# EAGLE schematic N_50412K (EAGLE 8.4.1)
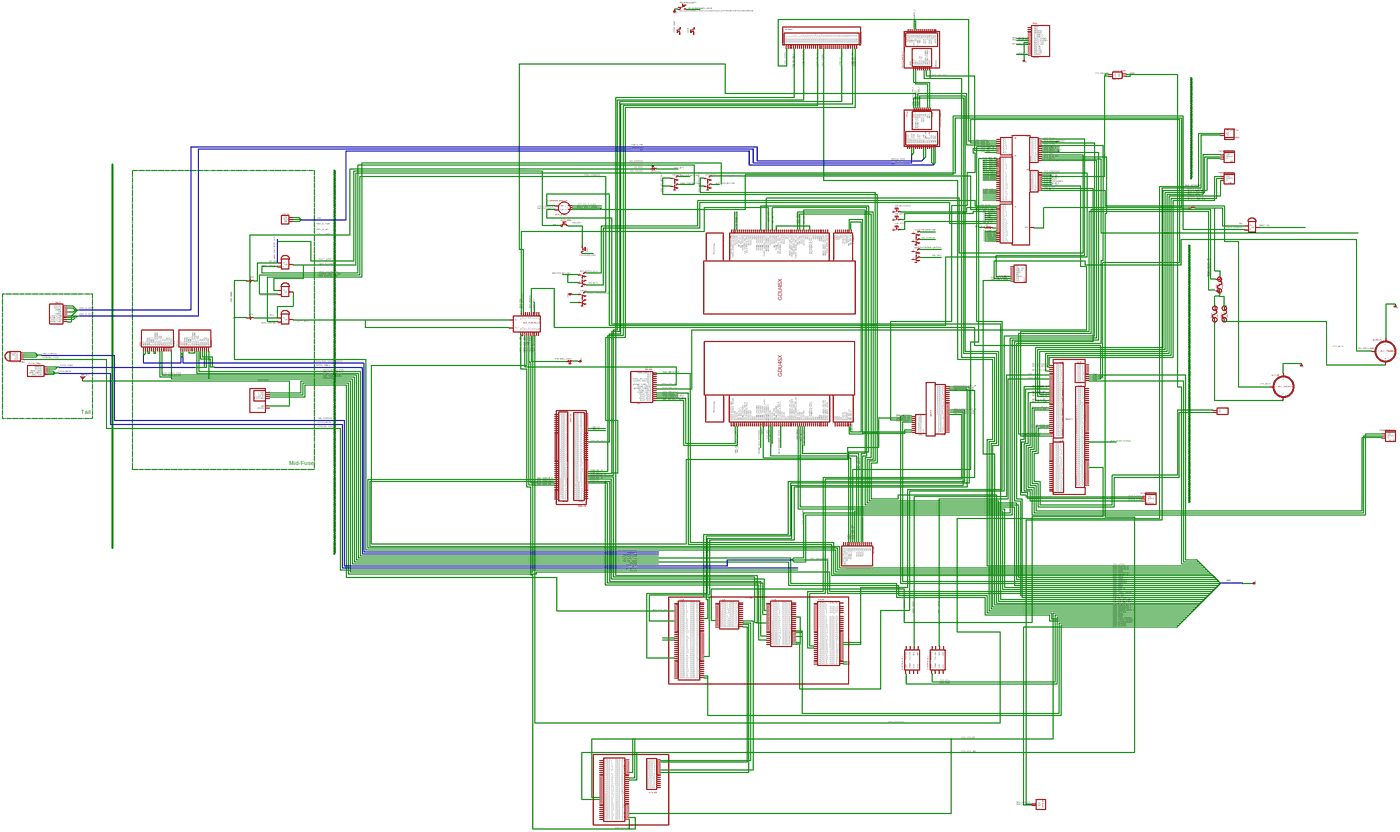
[diagram p0: schematic, sheet 1, overview]
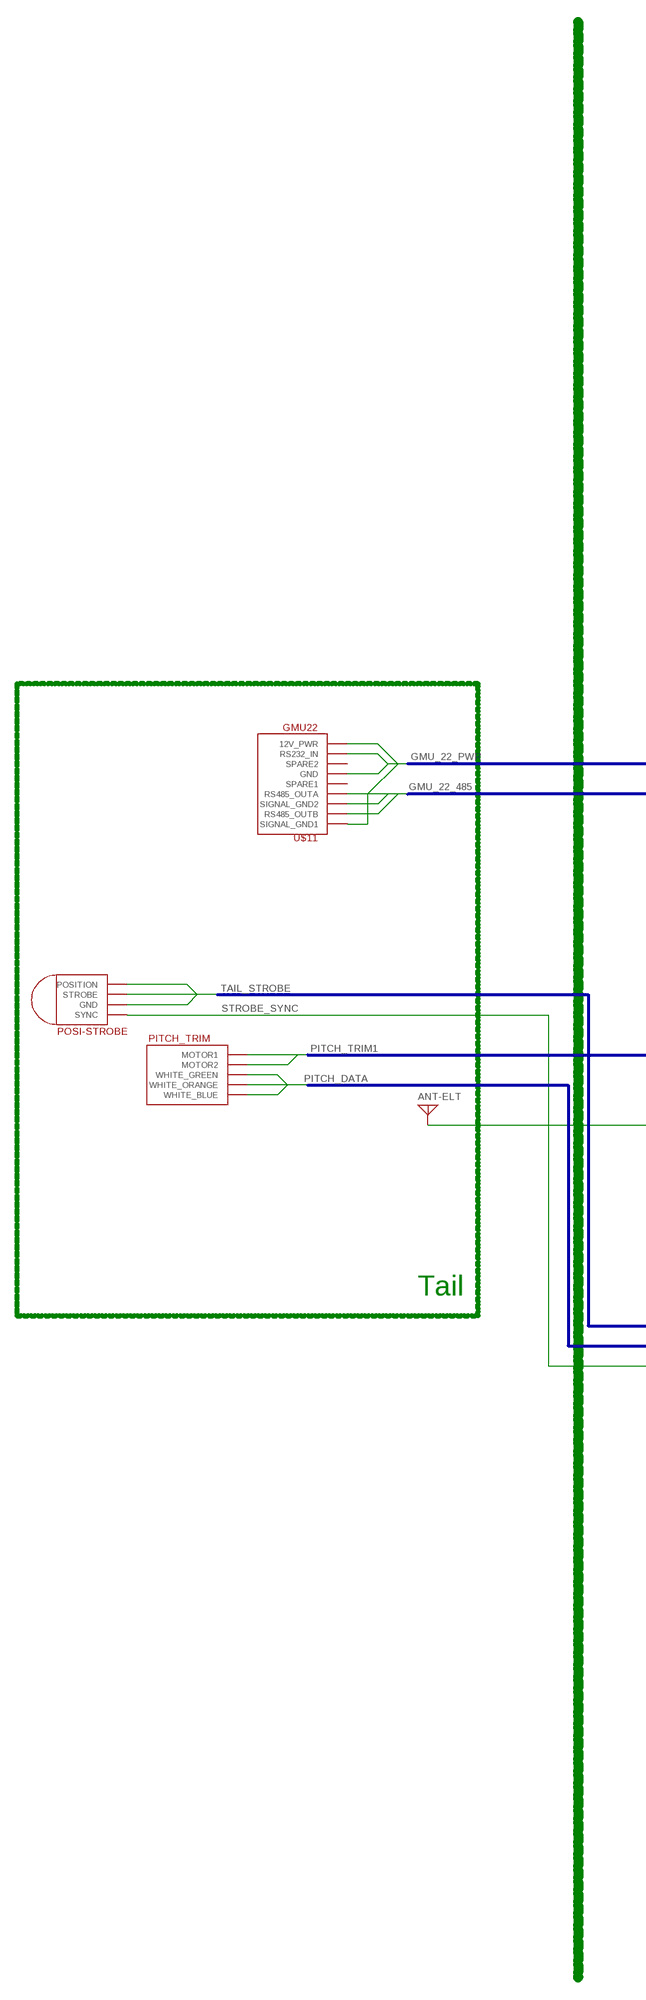
[diagram p1: schematic, sheet 1, part 1 of 8]
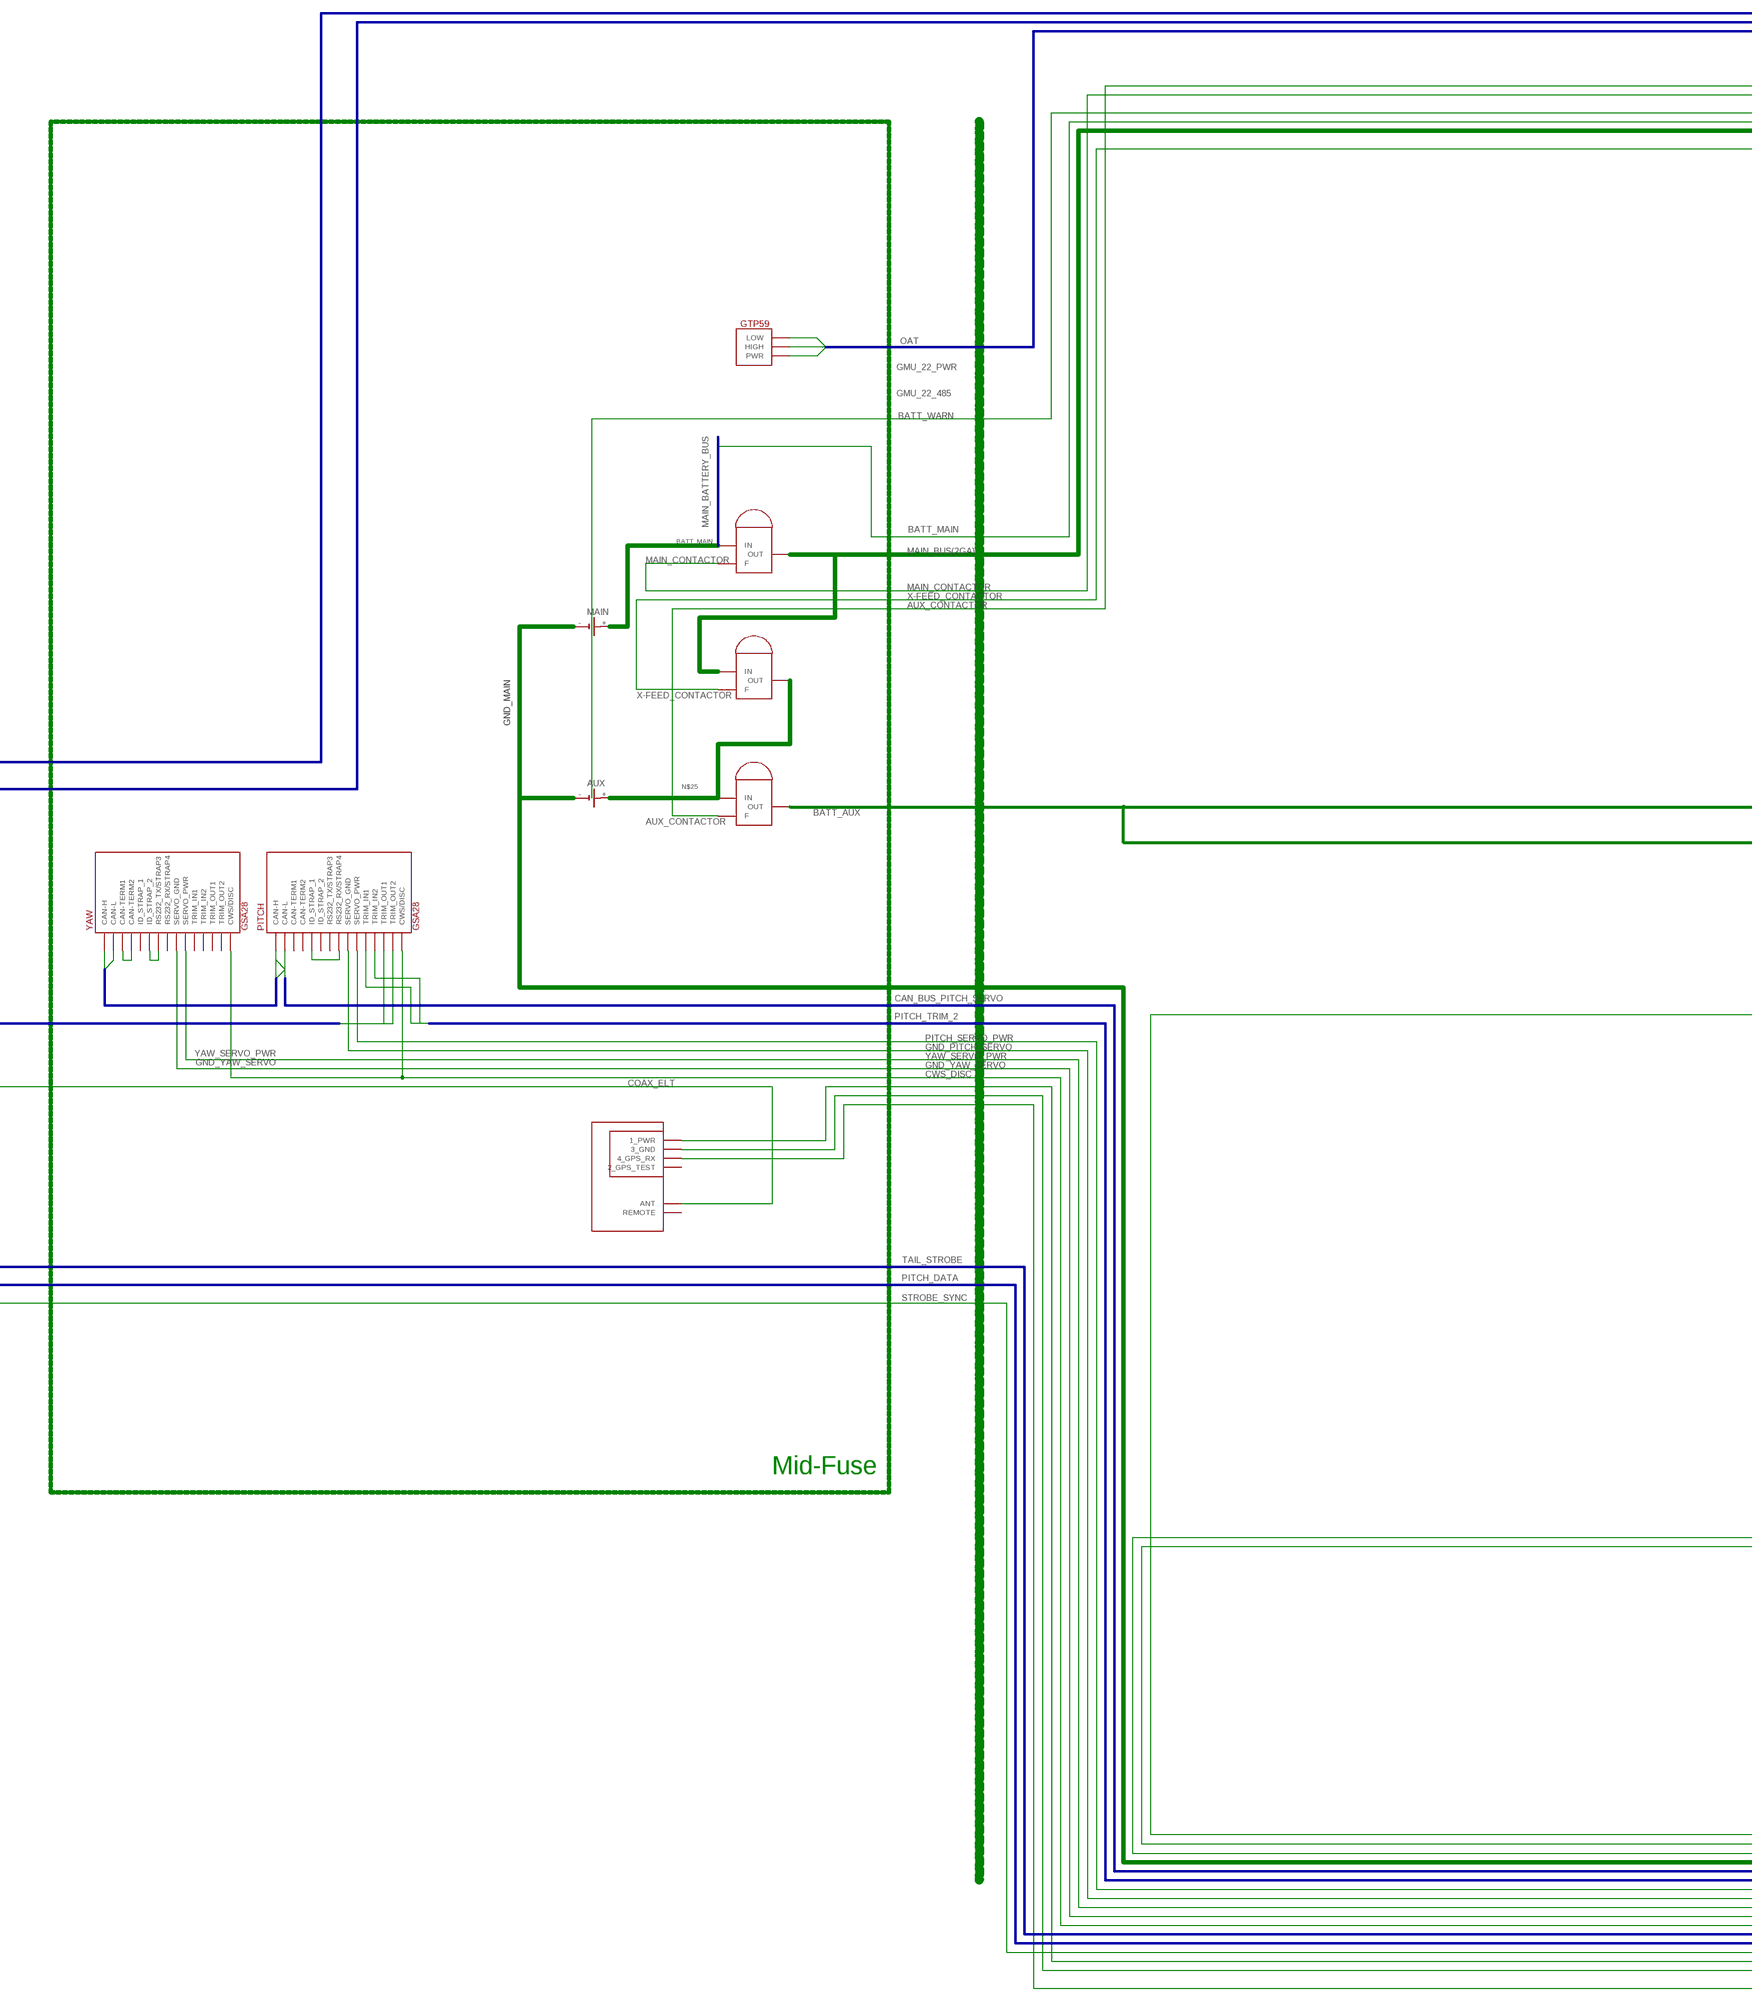
[diagram p2: schematic, sheet 1, part 2 of 8]
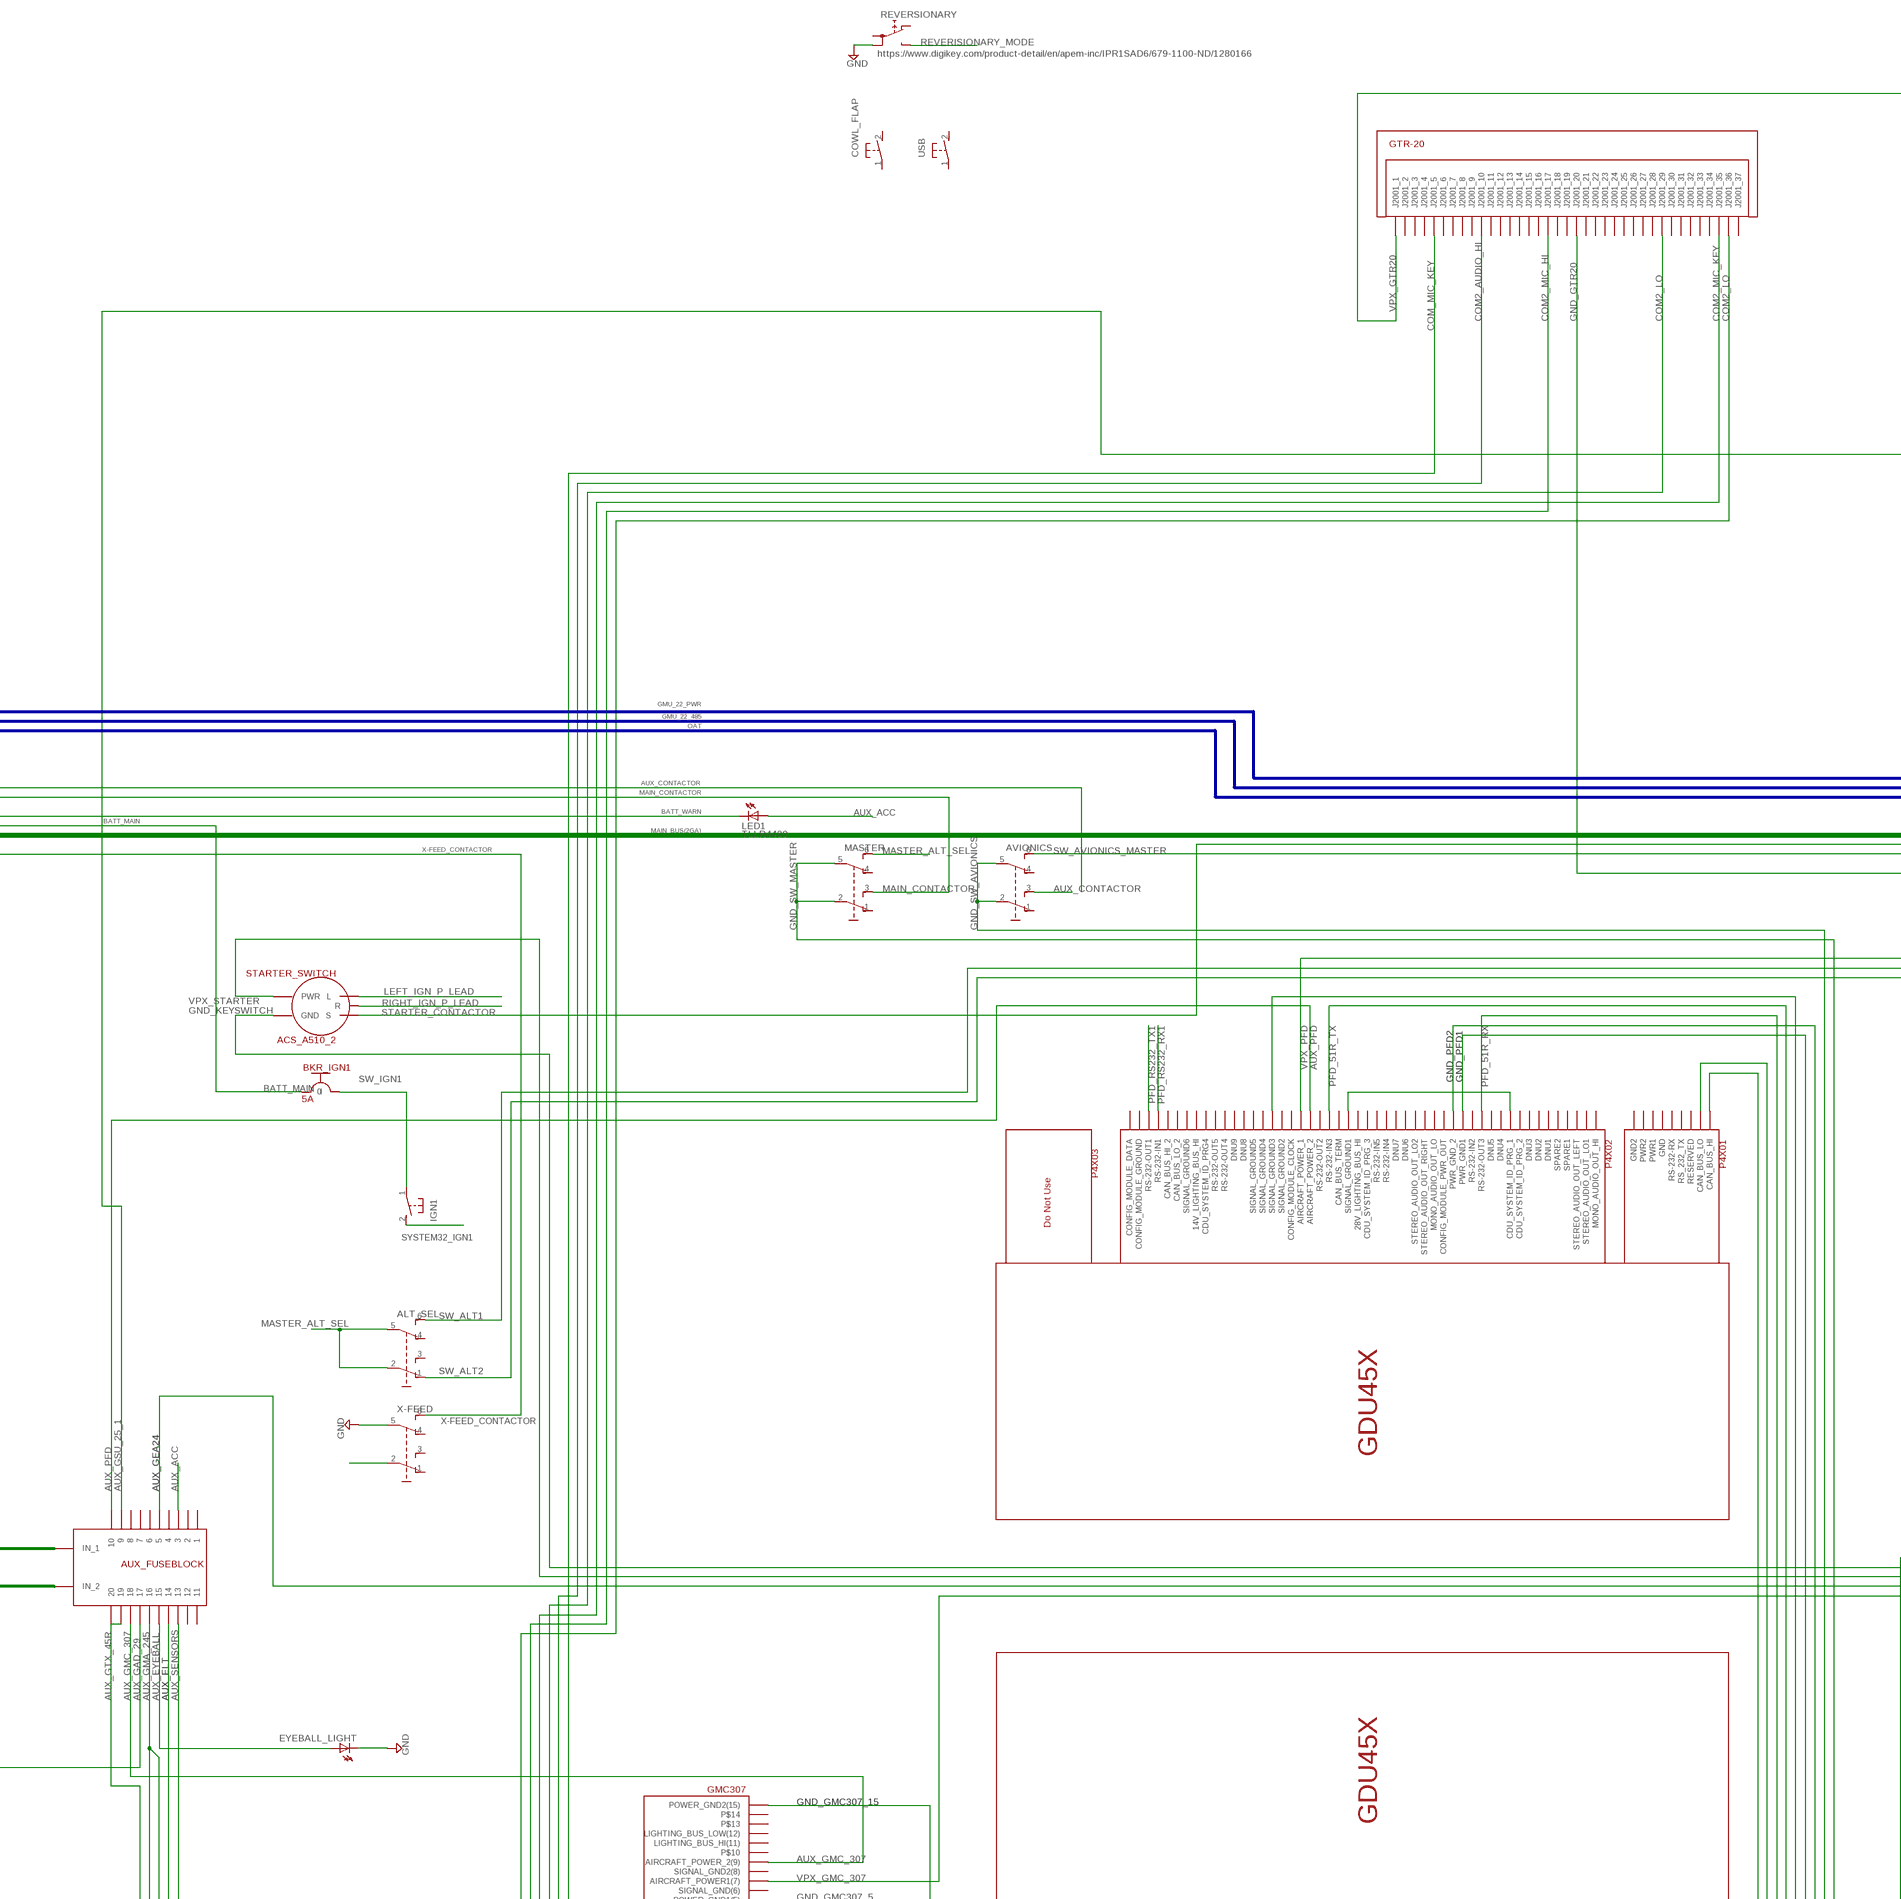
[diagram p3: schematic, sheet 1, part 3 of 8]
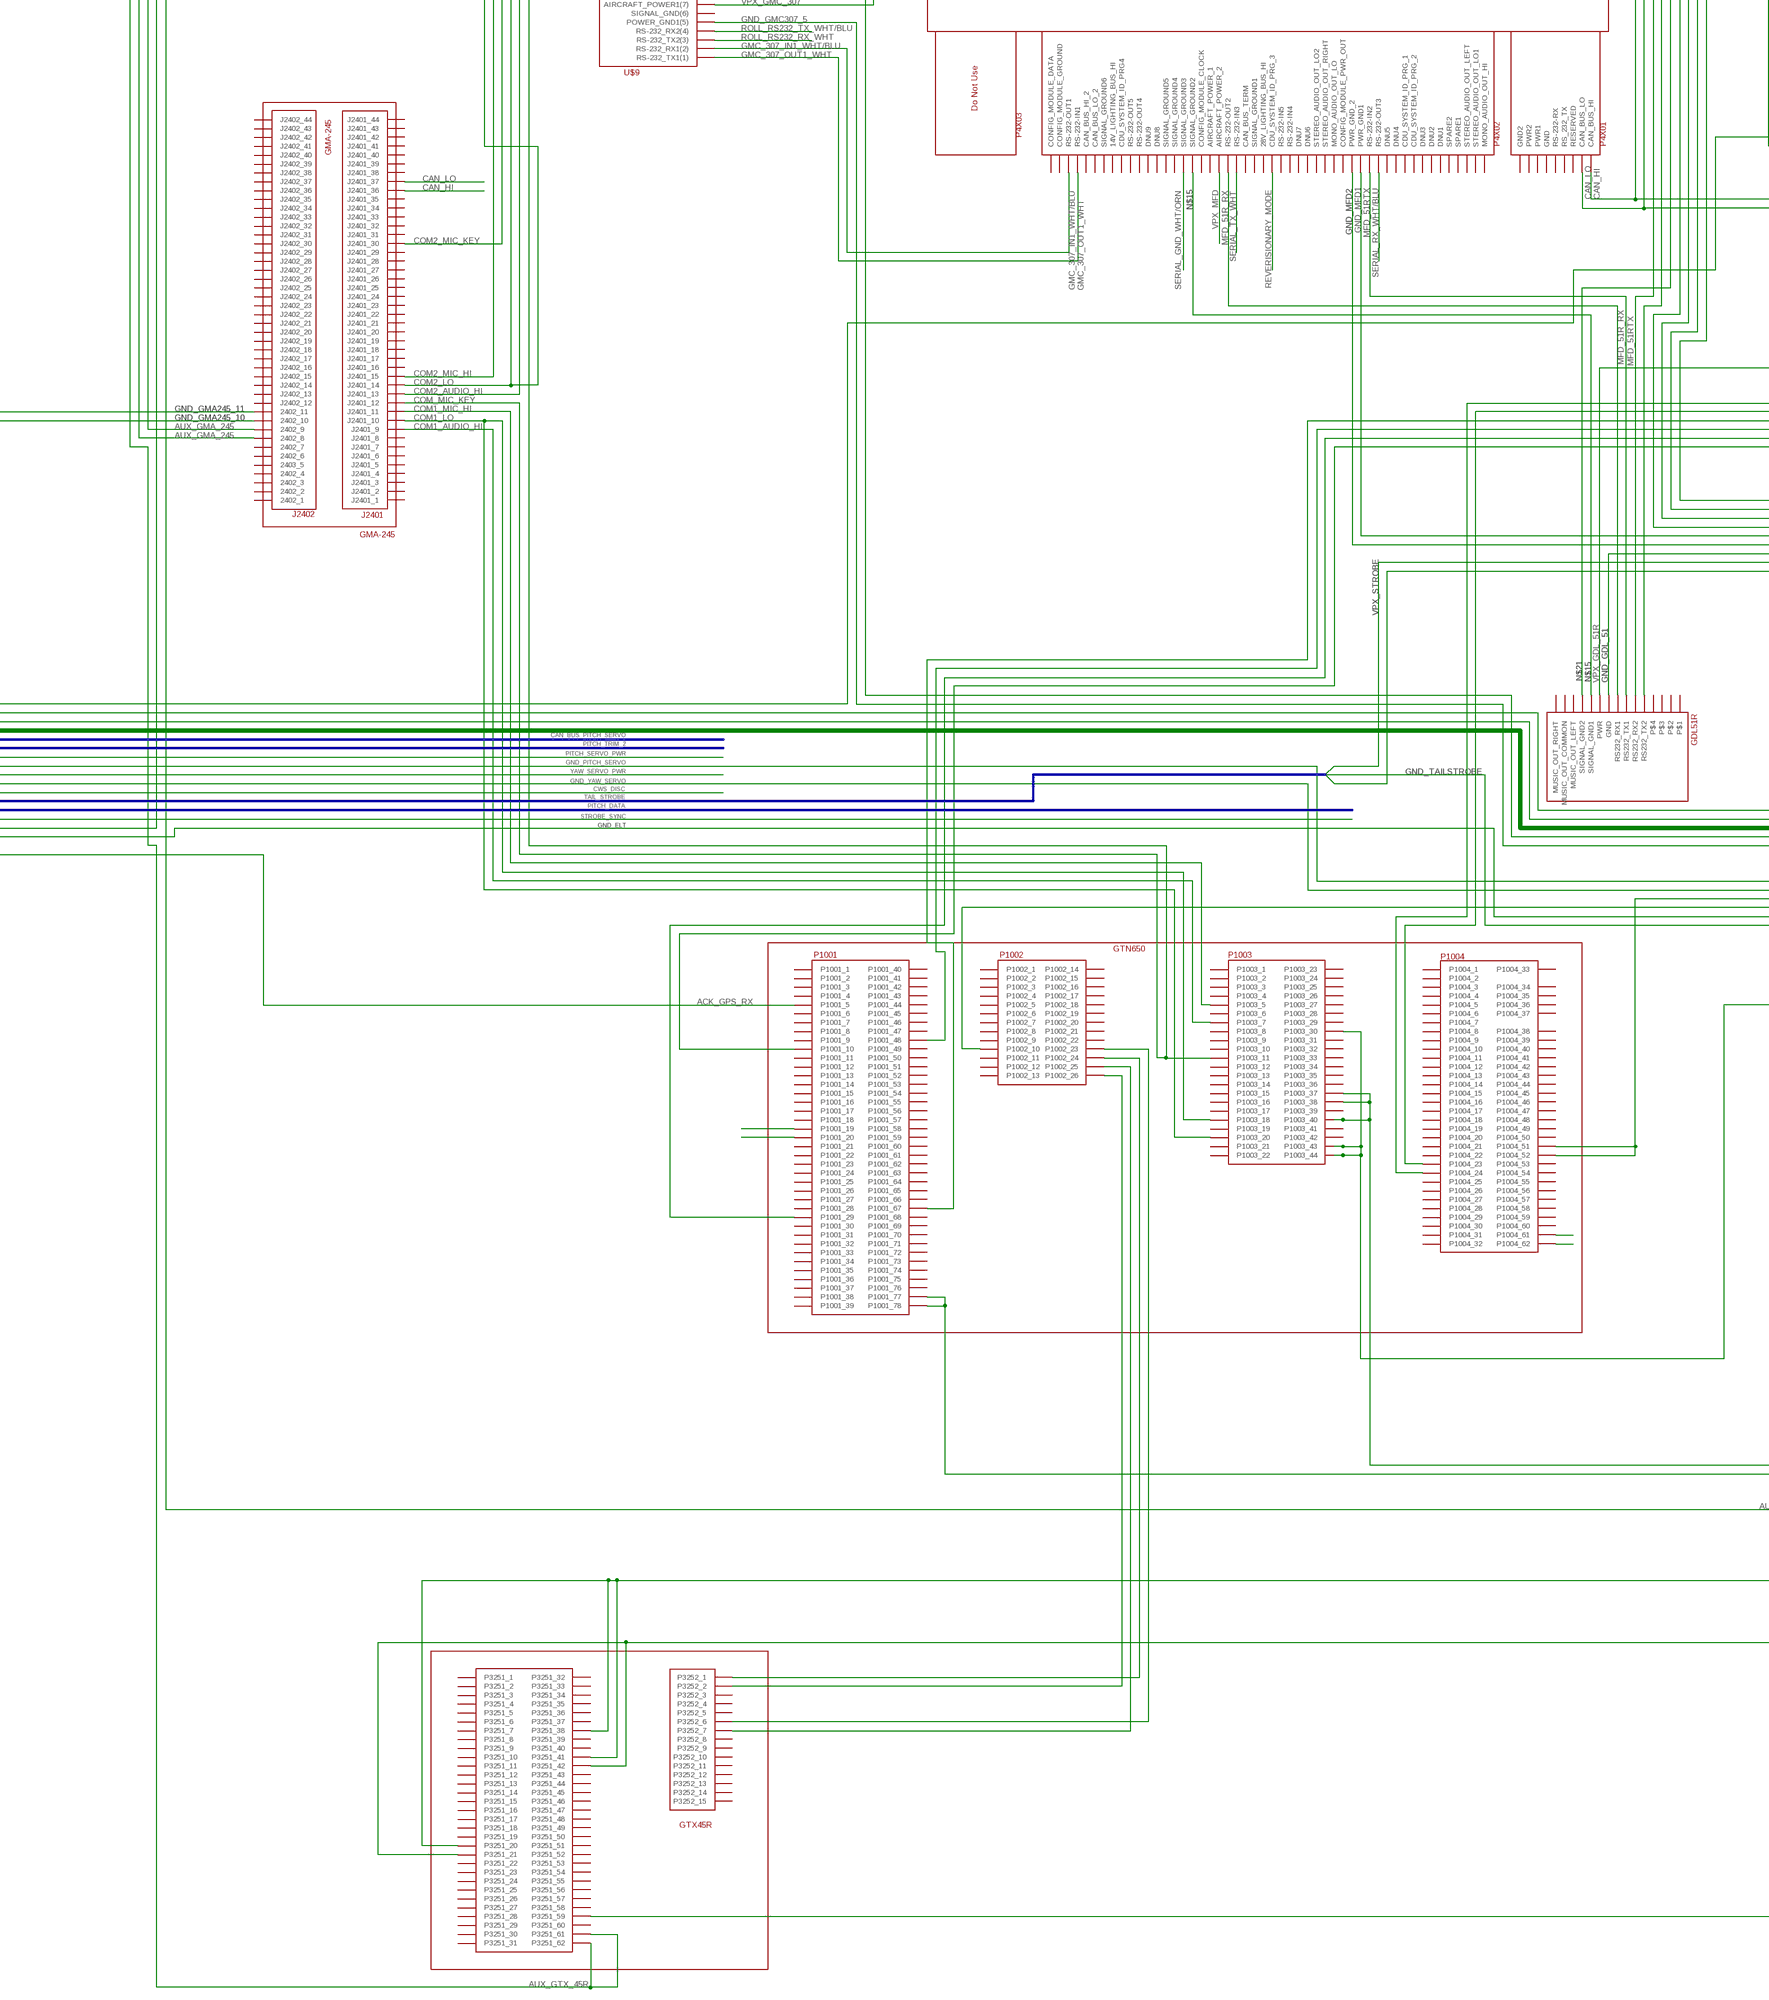
[diagram p4: schematic, sheet 1, part 4 of 8]
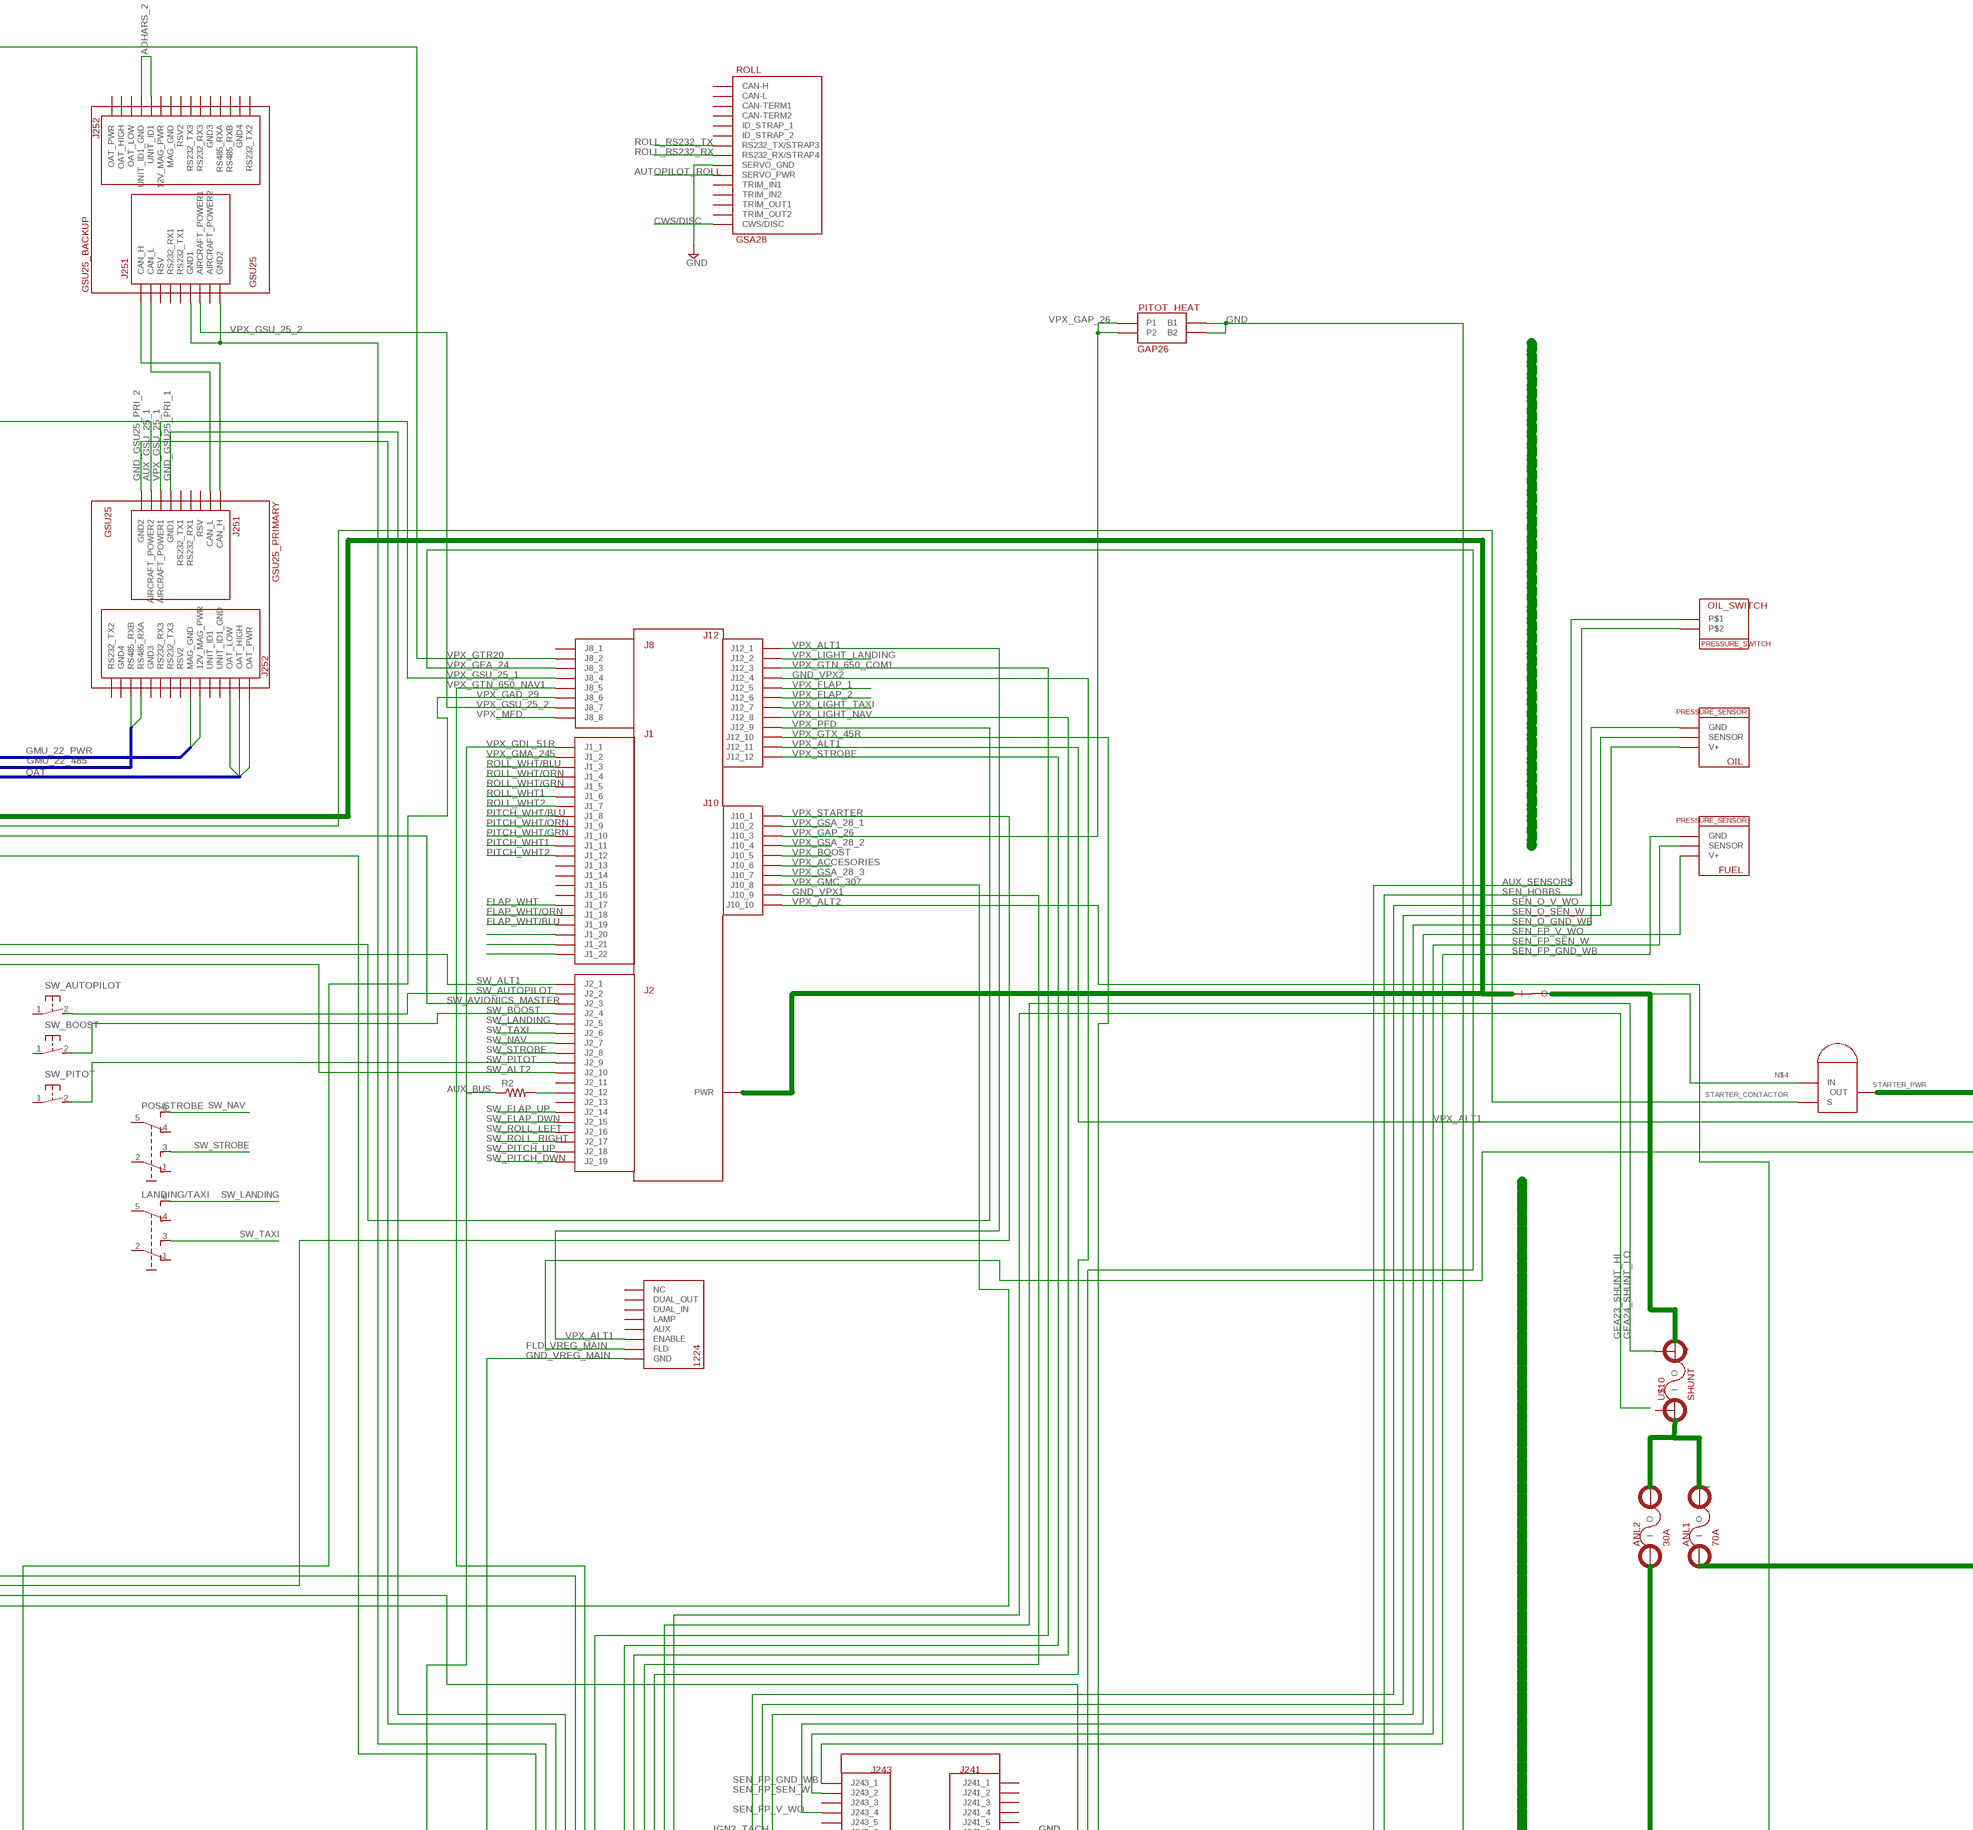
[diagram p5: schematic, sheet 1, part 5 of 8]
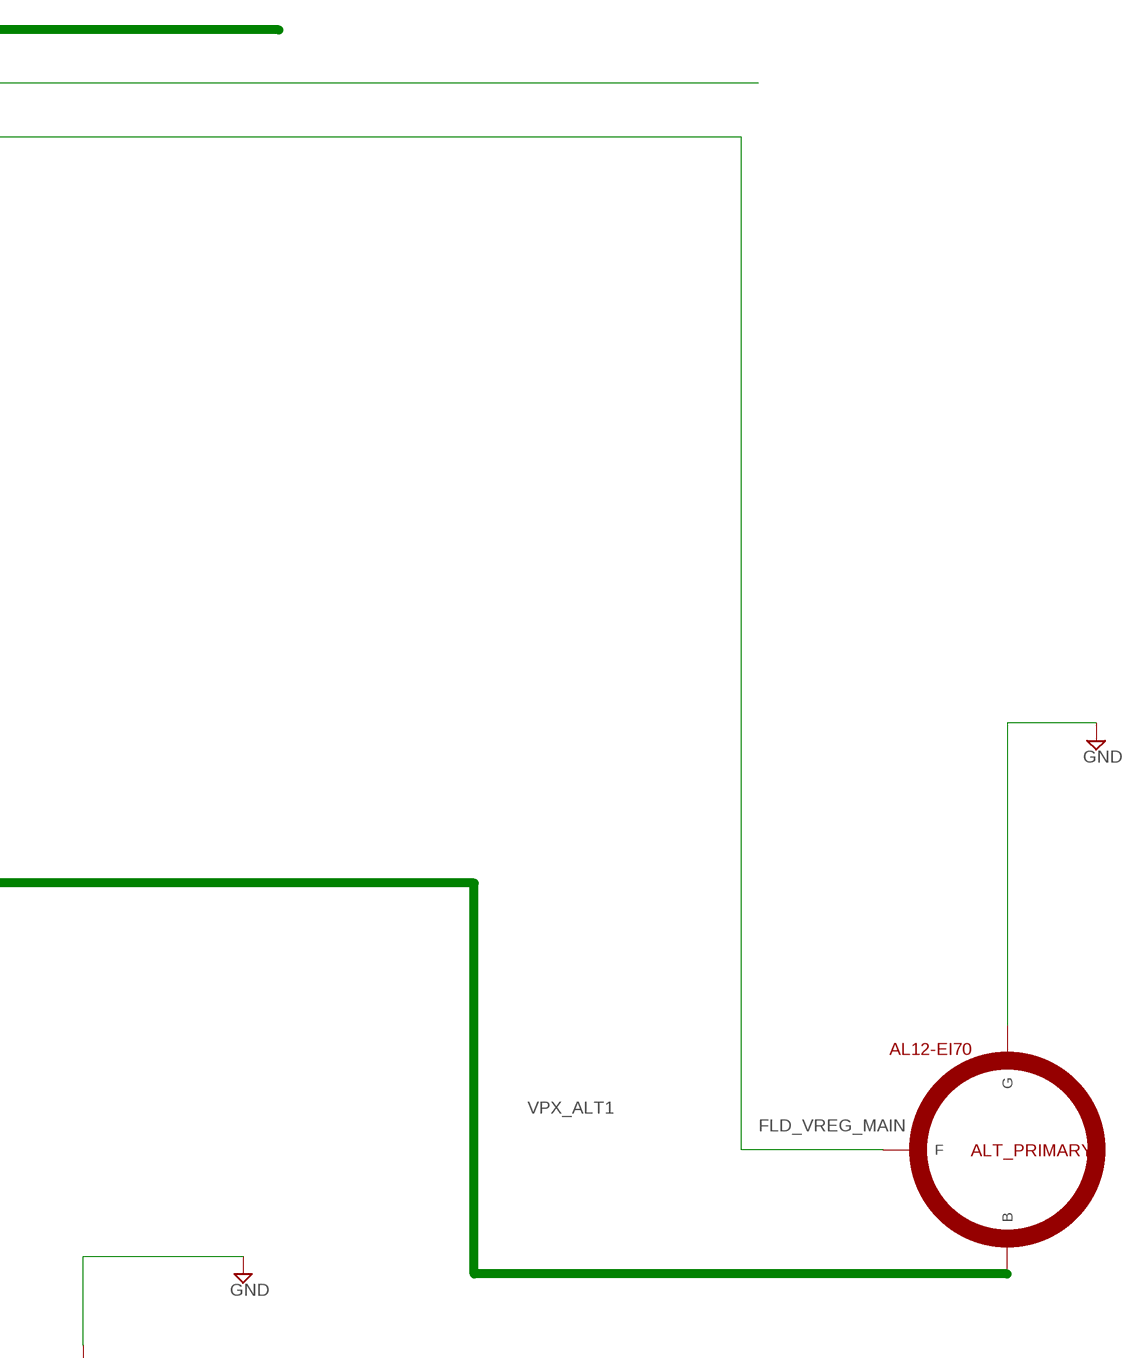
[diagram p6: schematic, sheet 1, part 6 of 8]
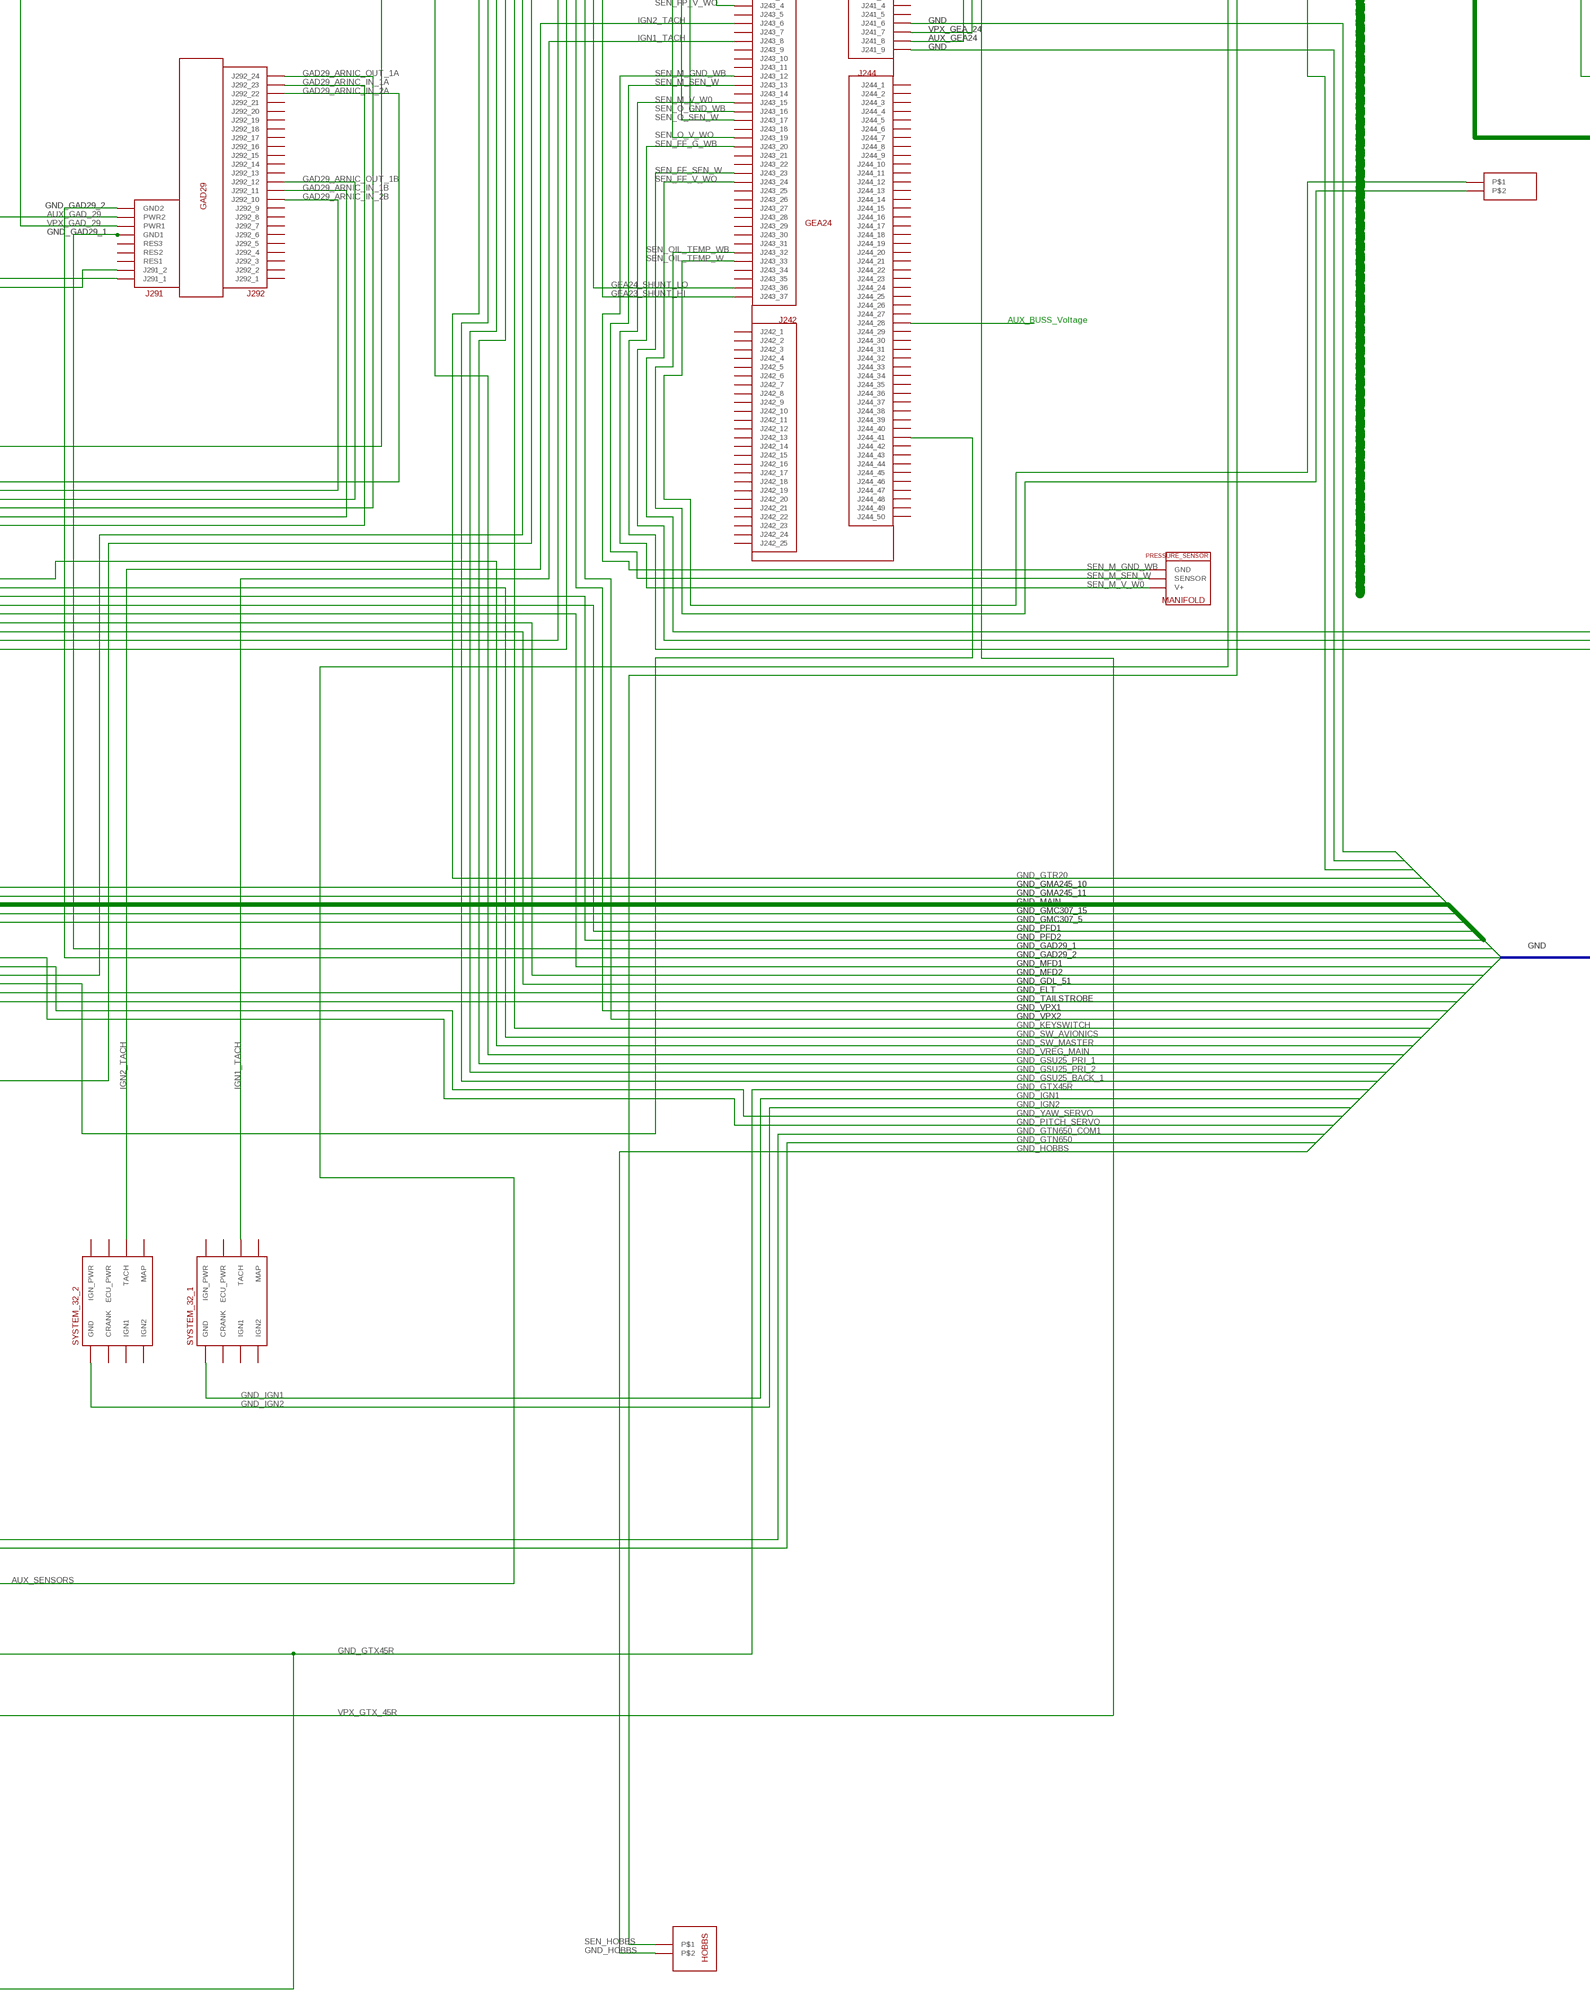
[diagram p7: schematic, sheet 1, part 7 of 8]
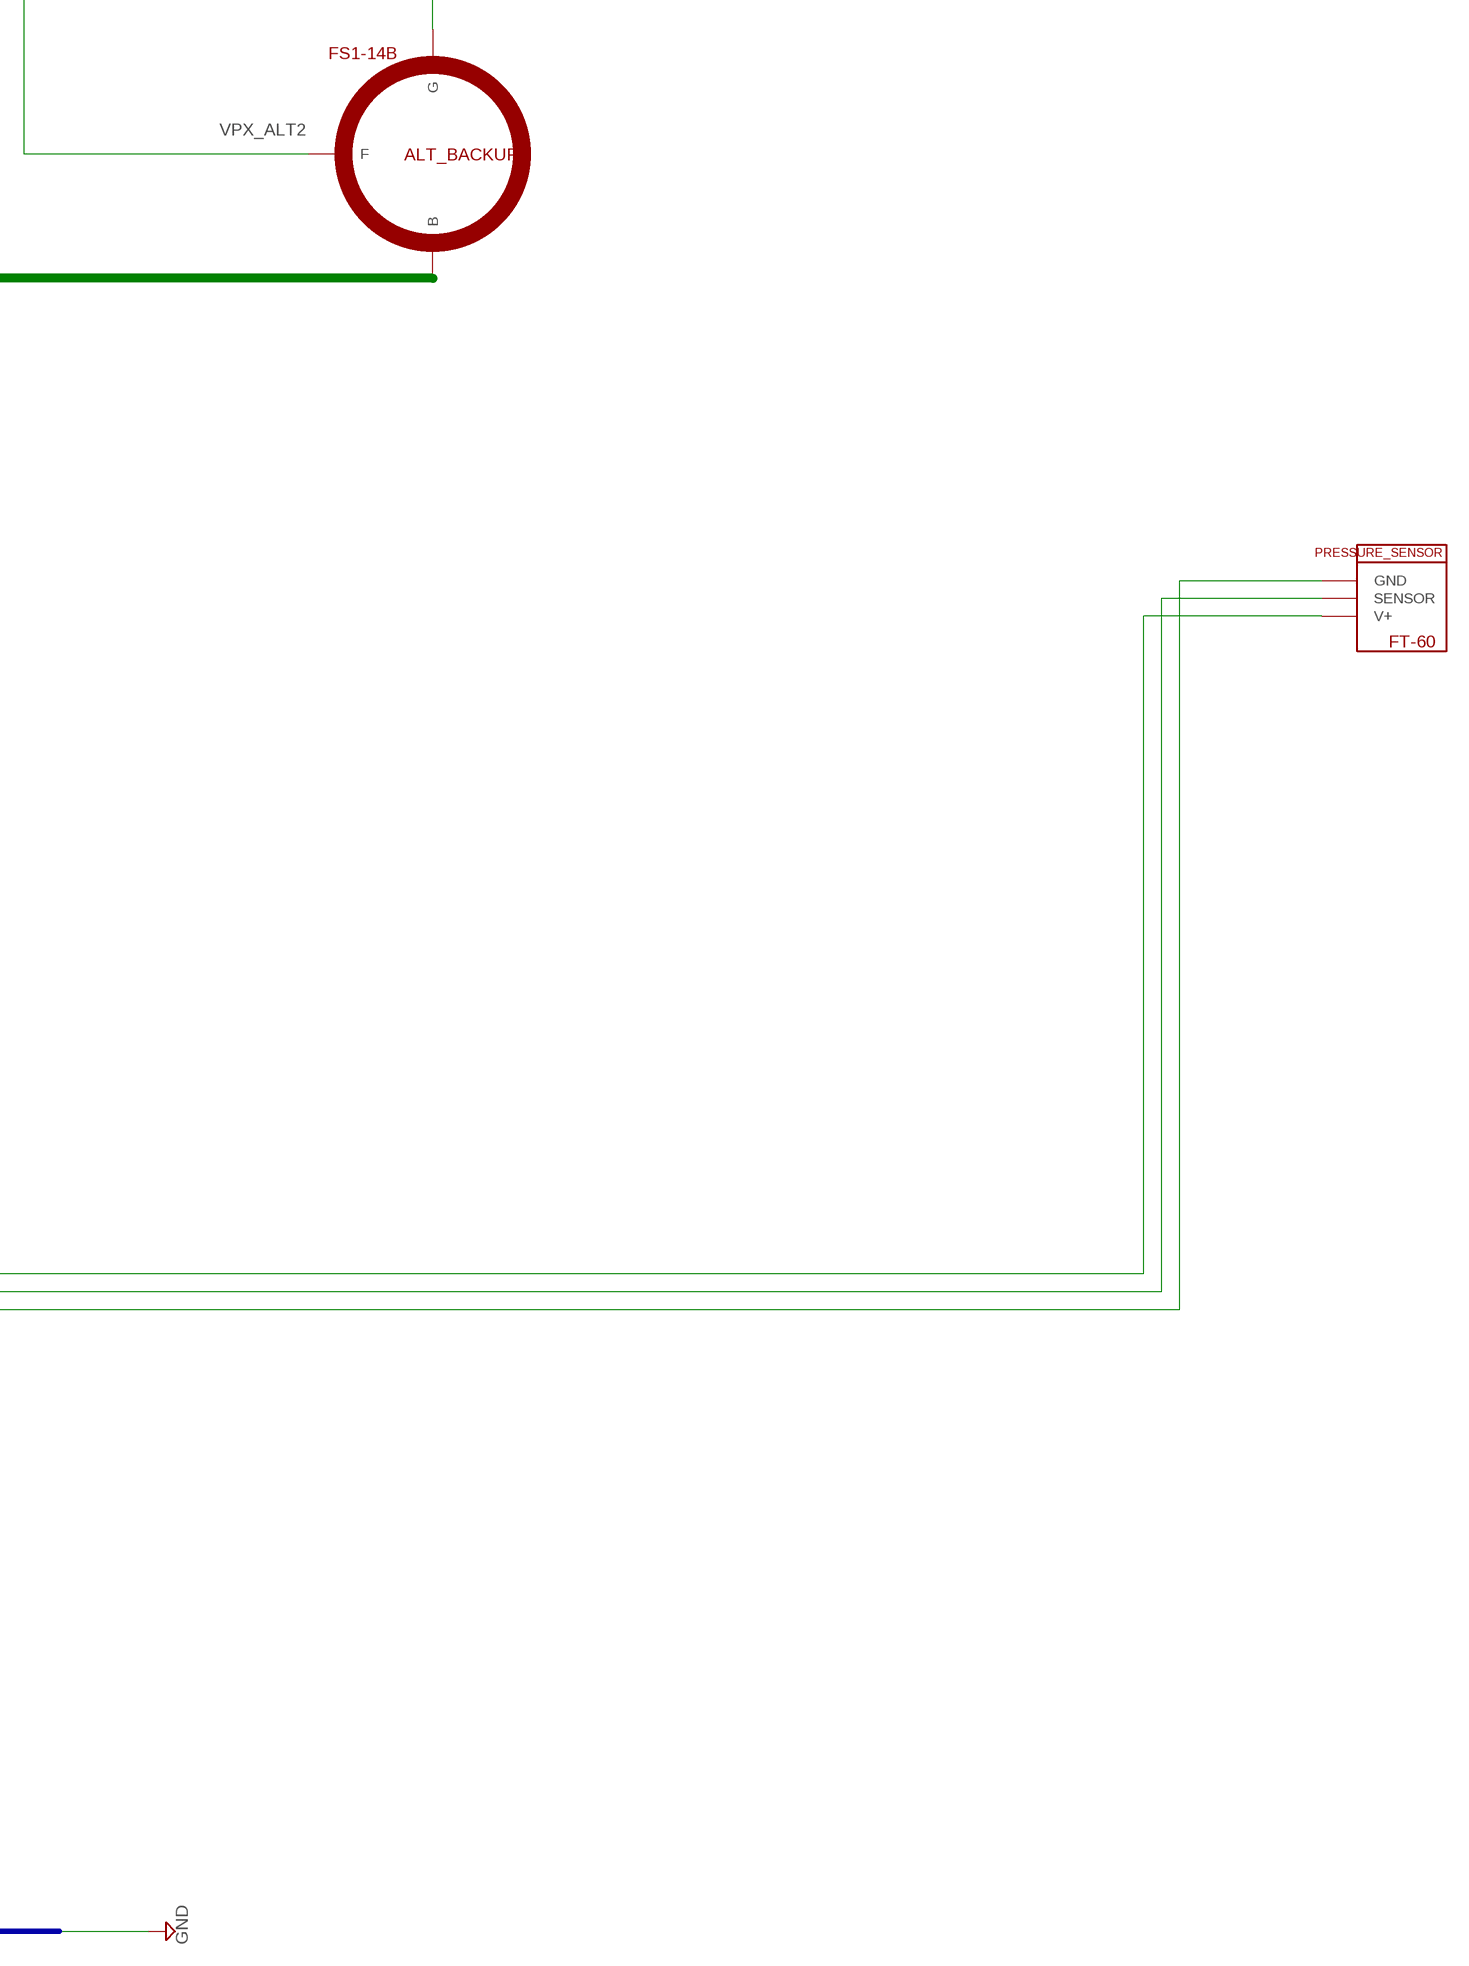
[diagram p8: schematic, sheet 1, part 8 of 8]

## Parts
1224  PLANEPWR_VREG  (no package)
ALT_BACKUP  FS1-14B  PLANE_POWER  (no package)
ALT_PRIMARY  AL12-EI70  PLANE_POWER  (no package)
ALT_SEL  TL46YO  [TL4XYO]
ANL1  70A  ANL  (no package)
ANL2  30A  ANL  (no package)
ANT-ELT  ANTENNA  [PAD-01]
AUX  SL-160AA/PR  [SL-160AA/PR]
AUX_FUSEBLOCK  11-13348  (no package)
AVIONICS  TL46YO  [TL4XYO]
BKR_IGN1  5A  BREAKER  (no package)
COWL_FLAP  31-XX  [B3F-31XX]
EYEBALL_LIGHT  LEDIRL80A  [IRL80A]
FT-60  PRESSURE_SENSOR  (no package)
FUEL  PRESSURE_SENSOR  (no package)
GAD29  GAD29  (no package)
GDL51R  GDL51  (no package)
GEA24  GEA24  (no package)
GMA-245  GMA-245  (no package)
GSU25_BACKUP  GSU25  (no package)
GSU25_PRIMARY  GSU25  (no package)
GTN650  GTN_650  (no package)
GTP59  GTP59  (no package)
GTR-20  GTR20  (no package)
GTX45R  GTX45R  (no package)
IGN1  31-XX  [B3F-31XX]
LANDING/TAXI  TL46YO  [TL4XYO]
LED1  TLLR4400  [LED3MM]
MAIN  SL-160AA/PR  [SL-160AA/PR]
MANIFOLD  PRESSURE_SENSOR  (no package)
MASTER  TL46YO  [TL4XYO]
MASTER_CONTACTOR  MASTER_CONTACTOR  (no package)
MASTER_CONTACTOR1  MASTER_CONTACTOR  (no package)
MASTER_CONTACTOR2  MASTER_CONTACTOR  (no package)
OIL  PRESSURE_SENSOR  (no package)
OIL_SWITCH  PRESSURE_SWITCH  (no package)
PITCH  GSA28  (no package)
PITCH_TRIM  RAYALLEN_T2  (no package)
PITOT_HEAT  GAP26  (no package)
POS/STROBE  TL46YO  [TL4XYO]
POSI-STROBE  POSISTROBE  (no package)
R2  R-US_0922/22  [0922/22]
REVERSIONARY  https://www.digikey.com/product-detail/en/apem-inc/IPR1SAD6/679-1100-ND/1280166  5501  [5501]
ROLL  GSA28  (no package)
STARTER_SWITCH  ACS_A510_2  (no package)
SW_AUTOPILOT  31-XX  [B3F-31XX]
SW_BOOST  31-XX  [B3F-31XX]
SW_PITOT  31-XX  [B3F-31XX]
SYSTEM_32_1  SYSTEM_32  (no package)
SYSTEM_32_2  SYSTEM_32  (no package)
U$1  VPX_PRO  (no package)
U$2  STARTER_CONTACTOR  (no package)
U$3  HOBBS_METER  (no package)
U$4  GDU_45X  (no package)
U$5  GDU_45X  (no package)
U$6  BULKHEAD  (no package)
U$7  ACK_E04  (no package)
U$8  THERMOCOUPLE  (no package)
U$9  GMC307  (no package)
U$10  SHUNT  (no package)
U$11  GMU22  (no package)
USB  31-XX  [B3F-31XX]
X-FEED  TL46YO  [TL4XYO]
YAW  GSA28  (no package)

## Nets
ACK_GPS_RX: GTN650.P1001_5 U$7.4_GPS_RX
ADHARS_2: GSU25_BACKUP.UNIT_ID1 GSU25_BACKUP.UNIT_ID1_GND
AUTOPILOT_ROLL: ROLL.SERVO_PWR
AUX_ACC: AUX_FUSEBLOCK.3 LED1.A
AUX_BUS: R2.1
AUX_CONTACTOR: AVIONICS.3(S) MASTER_CONTACTOR1.F
AUX_ELT: AUX_FUSEBLOCK.14 U$7.1_PWR
AUX_EYEBALL: AUX_FUSEBLOCK.15 EYEBALL_LIGHT.A
AUX_GAD_29: AUX_FUSEBLOCK.17 GAD29.PWR2
AUX_GEA24: AUX_FUSEBLOCK.5 GEA24.J241_8
AUX_GMA_245: AUX_FUSEBLOCK.16 GMA-245.2402_8 GMA-245.2402_9
AUX_GMC_307: AUX_FUSEBLOCK.18 U$9.AIRCRAFT_POWER_2(9)
AUX_GSU_25_1: AUX_FUSEBLOCK.9 GSU25_PRIMARY.AIRCRAFT_POWER2
AUX_GTX_45R: AUX_FUSEBLOCK.19 GTX45R.P3251_61 GTX45R.P3251_62
AUX_PFD: AUX_FUSEBLOCK.10 U$4.AIRCRAFT_POWER_2
AUX_SENSORS: AUX_FUSEBLOCK.13 OIL_SWITCH.P$1
B$1: GSU25_PRIMARY.OAT_HIGH GSU25_PRIMARY.OAT_LOW GSU25_PRIMARY.OAT_PWR PITCH.TRIM_IN1 PITCH.TRIM_IN2
B$2: PITCH.TRIM_OUT1 PITCH.TRIM_OUT2 PITCH_TRIM.MOTOR1 PITCH_TRIM.MOTOR2
B$3: PITCH_TRIM.WHITE_BLUE PITCH_TRIM.WHITE_GREEN PITCH_TRIM.WHITE_ORANGE
B$7: PITCH.CAN-H PITCH.CAN-L
BATT_AUX: AUX_FUSEBLOCK.IN_1 AUX_FUSEBLOCK.IN_2 MASTER_CONTACTOR1.OUT
BATT_MAIN: BKR_IGN1.I MAIN.+ MASTER_CONTACTOR.IN
BATT_WARN: LED1.K(C)
CAN_HI: GAD29.J291_1 GMA-245.J2401_36 U$4.CAN_BUS_HI U$5.CAN_BUS_HI YAW.CAN-H
CAN_LO: GAD29.J291_2 GMA-245.J2401_37 U$4.CAN_BUS_LO U$5.CAN_BUS_LO YAW.CAN-L
COAX_ELT: ANT-ELT.1 U$7.ANT
COM1_AUDIO_HI: GMA-245.J2401_9 GTN650.P1003_7
COM1_LO: GMA-245.J2401_10 GTN650.P1003_18 GTN650.P1003_20
COM1_MIC_HI: GMA-245.J2401_11 GTN650.P1003_5
COM2_AUDIO_HI: GMA-245.J2401_13 GTR-20.J2001_10
COM2_LO: GMA-245.J2401_14 GTR-20.J2001_29 GTR-20.J2001_36
COM2_MIC_HI: GMA-245.J2401_15 GTR-20.J2001_17
COM2_MIC_KEY: GMA-245.J2401_30 GTR-20.J2001_35
COM_MIC_KEY: GMA-245.J2401_12 GTN650.P1003_11 GTR-20.J2001_5
CWS/DISC: ROLL.CWS/DISC
CWS_DISC: PITCH.CWS/DISC YAW.CWS/DISC
FLAP_WHT: U$1.J1_17
FLAP_WHT/BLU: U$1.J1_19
FLAP_WHT/ORN: U$1.J1_18
FLD_VREG_MAIN: 1224.FLD ALT_PRIMARY.F
GAD29_ARINC_IN_1A: GAD29.J292_23 GTN650.P1001_10
GAD29_ARNIC_IN_1B: GAD29.J292_11 GTN650.P1001_29
GAD29_ARNIC_IN_2A: GAD29.J292_22 GTN650.P1004_24
GAD29_ARNIC_IN_2B: GAD29.J292_10 GTN650.P1004_23
GAD29_ARNIC_OUT_1A: GAD29.J292_24 GTN650.P1001_48
GAD29_ARNIC_OUT_1B: GAD29.J292_12 GTN650.P1001_67
GEA23_SHUNT_HI: GEA24.J243_37
GEA24_SHUNT_LO: GEA24.J243_36 U$10.2
GMC_307_IN1_WHT/BLU: U$5.RS-232-OUT1 U$9.RS-232_RX1(2)
GMC_307_OUT1_WHT: U$5.RS-232-IN1 U$9.RS-232_TX1(1)
GMU_22_485: GSU25_PRIMARY.RS485_RXA GSU25_PRIMARY.RS485_RXB
GMU_22_485_SHIELD: U$11.SIGNAL_GND2
GMU_22_485_W: U$11.RS485_OUTA
GMU_22_485_WB: U$11.RS485_OUTB
GMU_22_PWR: GSU25_PRIMARY.12V_MAG_PWR GSU25_PRIMARY.MAG_GND
GMU_22_PWR_SHIELD: U$11.SIGNAL_GND1
GMU_22_PWR_W: U$11.RS232_IN
GMU_22_PWR_WB: U$11.GND
GMU_22_PWR_WO: U$11.12V_PWR
GND: ALT_BACKUP.G ALT_PRIMARY.G EYEBALL_LIGHT.K(C) GEA24.J241_6 GEA24.J241_9 PITOT_HEAT.B1 PITOT_HEAT.B2 REVERSIONARY.1B ROLL.SERVO_GND X-FEED.5(P1)
GND_ELT: U$7.3_GND
GND_GAD29_1: GAD29.GND1
GND_GAD29_2: GAD29.GND2
GND_GDL_51: GDL51R.GND
GND_GMA245_10: GMA-245.2402_10
GND_GMA245_11: GMA-245.2402_11
GND_GMC307_5: U$9.POWER_GND1(5)
GND_GMC307_15: U$9.POWER_GND2(15)
GND_GSU25_BACK_1: GSU25_BACKUP.GND1 GSU25_BACKUP.GND2
GND_GSU25_PRI_1: GSU25_PRIMARY.GND1
GND_GSU25_PRI_2: GSU25_PRIMARY.GND2
GND_GTN650: GTN650.P1001_77 GTN650.P1001_78
GND_GTN650_COM1: GTN650.P1003_37 GTN650.P1003_38 GTN650.P1003_40
GND_GTR20: GTR-20.J2001_20
GND_GTX45R: GTX45R.P3251_20 GTX45R.P3251_38 GTX45R.P3251_41 GTX45R.P3251_59
GND_HOBBS: U$3.P$2
GND_IGN1: SYSTEM_32_1.GND
GND_IGN2: SYSTEM_32_2.GND
GND_KEYSWITCH: STARTER_SWITCH.GND
GND_MAIN: AUX.- MAIN.-
GND_MFD1: U$5.PWR_GND1
GND_MFD2: U$5.PWR_GND_2
GND_PFD1: U$4.PWR_GND1
GND_PFD2: U$4.PWR_GND_2
GND_PITCH_SERVO: PITCH.SERVO_GND
GND_SW_AVIONICS: AVIONICS.2(P) AVIONICS.5(P1)
GND_SW_MASTER: MASTER.2(P) MASTER.5(P1)
GND_VPX1: U$1.J10_9
GND_VPX2: U$1.J12_4
GND_VREG_MAIN: 1224.GND
GND_YAW_SERVO: YAW.SERVO_GND
IGN1_TACH: GEA24.J243_8 SYSTEM_32_1.TACH
IGN2_TACH: GEA24.J243_6 SYSTEM_32_2.TACH
LEFT_IGN_P_LEAD: STARTER_SWITCH.L
MAIN_BUS(2GA): MASTER_CONTACTOR2.IN MASTER_CONTACTOR.OUT U$1.PWR U$6.O
MAIN_CONTACTOR: MASTER.3(S) MASTER_CONTACTOR.F
MASTER_ALT_SEL: ALT_SEL.2(P) ALT_SEL.5(P1) MASTER.6(S1)
MFD_51R_RX: GDL51R.RS232_RX1 U$5.RS-232-OUT2
MFD_51RTX: GDL51R.RS232_TX1 U$5.RS-232-IN2
N$1: R2.2 U$1.J2_12
N$2: GSU25_BACKUP.CAN_L GSU25_PRIMARY.CAN_L
N$3: U$1.J1_20
N$4: U$2.IN U$6.I U$10.O
N$6: ANL1.O ANL2.O U$10.I
N$7: GTN650.P1001_19
N$8: X-FEED.2(P)
N$9: ALT_PRIMARY.B ANL1.I
N$10: ALT_BACKUP.B ANL2.I
N$11: GSU25_BACKUP.CAN_H GSU25_PRIMARY.CAN_H
N$13: U$4.CDU_SYSTEM_ID_PRG_1 U$4.SIGNAL_GROUND1
N$15: GDL51R.SIGNAL_GND1 U$5.SIGNAL_GROUND2
N$16: U$1.J1_21
N$17: GTN650.P1002_24 GTX45R.P3252_1
N$18: GEA24.J244_28
N$21: GDL51R.SIGNAL_GND2 U$4.SIGNAL_GROUND3
N$22: U$1.J1_22
N$23: GTN650.P1001_20
N$25: AUX.+ MASTER_CONTACTOR1.IN MASTER_CONTACTOR2.OUT
N$33: GTN650.P1004_61
N$34: YAW.CAN-TERM1 YAW.CAN-TERM2
N$35: PITCH.ID_STRAP_1 PITCH.RS232_RX/STRAP4
N$36: YAW.ID_STRAP_2 YAW.RS232_TX/STRAP3
N$37: GTN650.P1004_62
N$45: GTN650.P1002_23 GTX45R.P3252_6
N$46: GTN650.P1002_25 GTX45R.P3252_7
N$47: GTN650.P1002_26 GTX45R.P3252_2
OAT: GTP59.HIGH GTP59.LOW GTP59.PWR
PFD_51R_RX: GDL51R.RS232_RX2 U$4.RS-232-OUT3
PFD_51R_TX: GDL51R.RS232_TX2 U$4.RS-232-IN3
PFD_RS232_RX1: U$4.RS-232-IN1
PFD_RS232_TX1: U$4.RS-232-OUT1
PITCH_SERVO_PWR: PITCH.SERVO_PWR
PITCH_WHT1: U$1.J1_11
PITCH_WHT2: U$1.J1_12
PITCH_WHT/BLU: U$1.J1_8
PITCH_WHT/GRN: U$1.J1_10
PITCH_WHT/ORN: U$1.J1_9
REVERISIONARY_MODE: REVERSIONARY.NO U$5.CDU_SYSTEM_ID_PRG_3
RIGHT_IGN_P_LEAD: STARTER_SWITCH.R
ROLL_RS232_RX: ROLL.RS232_RX/STRAP4
ROLL_RS232_RX_WHT: U$9.RS-232_TX2(3)
ROLL_RS232_TX: ROLL.RS232_TX/STRAP3
ROLL_RS232_TX_WHT/BLU: U$9.RS-232_RX2(4)
ROLL_WHT1: U$1.J1_6
ROLL_WHT2: U$1.J1_7
ROLL_WHT/BLU: U$1.J1_3
ROLL_WHT/GRN: U$1.J1_5
ROLL_WHT/ORN: U$1.J1_4
SEN_FF_G_WB: FT-60.GND GEA24.J243_20
SEN_FF_SEN_W: FT-60.SENSOR GEA24.J243_23
SEN_FF_V_WO: FT-60.V+ GEA24.J243_24
SEN_FP_GND_WB: FUEL.GND GEA24.J243_1
SEN_FP_SEN_W: FUEL.SENSOR GEA24.J243_2
SEN_FP_V_WO: FUEL.V+ GEA24.J243_4
SEN_HOBBS: OIL_SWITCH.P$2
SEN_M_GND_WB: GEA24.J243_12 MANIFOLD.GND
SEN_M_SEN_W: GEA24.J243_13 MANIFOLD.SENSOR
SEN_M_V_W0: GEA24.J243_15 MANIFOLD.V+
SEN_O_GND_WB: GEA24.J243_16 OIL.GND
SEN_O_SEN_W: GEA24.J243_17 OIL.SENSOR
SEN_O_V_WO: GEA24.J243_19 OIL.V+
SEN_OIL_TEMP_W: GEA24.J243_33 U$8.P$1
SEN_OIL_TEMP_WB: GEA24.J243_32 U$8.P$2
SERIAL_GND_WHT/ORN: U$5.SIGNAL_GROUND3
SERIAL_RX_WHT/BLU: U$5.RS-232-OUT3
SERIAL_TX_WHT: U$5.RS-232-IN3
STARTER_CONTACTOR: STARTER_SWITCH.S U$2.S
STARTER_PWR: U$2.OUT
STROBE_SYNC: POSI-STROBE.SYNC
SW_ALT1: ALT_SEL.6(S1) U$1.J2_1
SW_ALT2: ALT_SEL.1(O) U$1.J2_10
SW_AUTOPILOT: SW_AUTOPILOT.2(S) U$1.J2_2
SW_AVIONICS_MASTER: AVIONICS.6(S1) U$1.J2_3
SW_BOOST: SW_BOOST.2(S) U$1.J2_4
SW_FLAP_DWN: U$1.J2_15
SW_FLAP_UP: U$1.J2_14
SW_IGN1: BKR_IGN1.0 IGN1.1(P)
SW_LANDING: LANDING/TAXI.6(S1) U$1.J2_5
SW_NAV: POS/STROBE.6(S1) U$1.J2_7
SW_PITCH_DWN: U$1.J2_19
SW_PITCH_UP: U$1.J2_18
SW_PITOT: SW_PITOT.2(S) U$1.J2_9
SW_ROLL_LEFT: U$1.J2_16
SW_ROLL_RIGHT: U$1.J2_17
SW_STROBE: POS/STROBE.3(S) U$1.J2_8
SW_TAXI: LANDING/TAXI.3(S) U$1.J2_6
SYSTEM32_IGN1: IGN1.2(S)
TAIL_STROBE: POSI-STROBE.GND POSI-STROBE.POSITION POSI-STROBE.STROBE
TOGO: GEA24.J244_41 GTN650.P1002_10
VPX_ACCESORIES: U$1.J10_6
VPX_ALT1: 1224.ENABLE U$1.J12_1 U$1.J12_11
VPX_ALT2: ALT_BACKUP.F U$1.J10_10
VPX_BOOST: U$1.J10_5
VPX_FLAP_1: U$1.J12_5
VPX_FLAP_2: U$1.J12_6
VPX_GAD_29: GAD29.PWR1 U$1.J8_6
VPX_GAP_26: PITOT_HEAT.P1 PITOT_HEAT.P2 U$1.J10_3
VPX_GDL_51R: GDL51R.PWR U$1.J1_1
VPX_GEA_24: GEA24.J241_7 U$1.J8_3
VPX_GMA_245: U$1.J1_2
VPX_GMC_307: U$1.J10_8 U$9.AIRCRAFT_POWER1(7)
VPX_GSA_28_1: U$1.J10_2
VPX_GSA_28_2: U$1.J10_4
VPX_GSA_28_3: U$1.J10_7
VPX_GSU_25_1: GSU25_PRIMARY.AIRCRAFT_POWER1 U$1.J8_4
VPX_GSU_25_2: GSU25_BACKUP.AIRCRAFT_POWER1 U$1.J8_7
VPX_GTN_650_COM1: GTN650.P1003_30 GTN650.P1003_43 GTN650.P1003_44 U$1.J12_3
VPX_GTN_650_NAV1: GTN650.P1004_51 GTN650.P1004_52 U$1.J8_5
VPX_GTR20: GTR-20.J2001_1 U$1.J8_2
VPX_GTX_45R: GTX45R.P3251_21 GTX45R.P3251_42 U$1.J12_10
VPX_LIGHT_LANDING: U$1.J12_2
VPX_LIGHT_NAV: U$1.J12_8
VPX_LIGHT_TAXI: U$1.J12_7
VPX_MFD: U$1.J8_8 U$5.AIRCRAFT_POWER_2
VPX_PFD: U$1.J12_9 U$4.AIRCRAFT_POWER_1
VPX_STARTER: STARTER_SWITCH.PWR U$1.J10_1
VPX_STROBE: U$1.J12_12
X-FEED_CONTACTOR: MASTER_CONTACTOR2.F X-FEED.6(S1)
YAW_SERVO_PWR: YAW.SERVO_PWR
Unconnected: 1224.AUX 1224.DUAL_IN 1224.DUAL_OUT 1224.LAMP 1224.NC ALT_SEL.3(S) ALT_SEL.4(O1) AUX_FUSEBLOCK.1 AUX_FUSEBLOCK.2 AUX_FUSEBLOCK.4 AUX_FUSEBLOCK.6 AUX_FUSEBLOCK.7 AUX_FUSEBLOCK.8 AUX_FUSEBLOCK.11 AUX_FUSEBLOCK.12 AUX_FUSEBLOCK.20 AVIONICS.1(O) AVIONICS.4(O1) COWL_FLAP.1(P) COWL_FLAP.2(S) GAD29.J292_1 GAD29.J292_2 GAD29.J292_3 GAD29.J292_4 GAD29.J292_5 GAD29.J292_6 GAD29.J292_7 GAD29.J292_8 GAD29.J292_9 GAD29.J292_13 GAD29.J292_14 GAD29.J292_15 GAD29.J292_16 GAD29.J292_17 GAD29.J292_18 GAD29.J292_19 GAD29.J292_20 GAD29.J292_21 GAD29.RES1 GAD29.RES2 GAD29.RES3 GDL51R.MUSIC_OUT_COMMON GDL51R.MUSIC_OUT_LEFT GDL51R.MUSIC_OUT_RIGHT GDL51R.P$1 GDL51R.P$2 GDL51R.P$3 GDL51R.P$4 GEA24.J241_1 GEA24.J241_2 GEA24.J241_3 GEA24.J241_4 GEA24.J241_5 GEA24.J242_1 GEA24.J242_2 GEA24.J242_3 GEA24.J242_4 GEA24.J242_5 GEA24.J242_6 GEA24.J242_7 GEA24.J242_8 GEA24.J242_9 GEA24.J242_10 GEA24.J242_11 GEA24.J242_12 GEA24.J242_13 GEA24.J242_14 GEA24.J242_15 GEA24.J242_16 GEA24.J242_17 GEA24.J242_18 GEA24.J242_19 GEA24.J242_20 GEA24.J242_21 GEA24.J242_22 GEA24.J242_23 GEA24.J242_24 GEA24.J242_25 GEA24.J243_3 GEA24.J243_5 GEA24.J243_7 GEA24.J243_9 GEA24.J243_10 GEA24.J243_11 GEA24.J243_14 GEA24.J243_18 GEA24.J243_21 GEA24.J243_22 GEA24.J243_25 GEA24.J243_26 GEA24.J243_27 GEA24.J243_28 GEA24.J243_29 GEA24.J243_30 GEA24.J243_31 GEA24.J243_34 GEA24.J243_35 GEA24.J244_1 GEA24.J244_2 GEA24.J244_3 GEA24.J244_4 GEA24.J244_5 GEA24.J244_6 GEA24.J244_7 GEA24.J244_8 GEA24.J244_9 GEA24.J244_10 GEA24.J244_11 GEA24.J244_12 GEA24.J244_13 GEA24.J244_14 GEA24.J244_15 GEA24.J244_16 GEA24.J244_17 GEA24.J244_18 GEA24.J244_19 GEA24.J244_20 GEA24.J244_21 GEA24.J244_22 GEA24.J244_23 GEA24.J244_24 GEA24.J244_25 GEA24.J244_26 GEA24.J244_27 GEA24.J244_29 GEA24.J244_30 GEA24.J244_31 GEA24.J244_32 GEA24.J244_33 GEA24.J244_34 GEA24.J244_35 GEA24.J244_36 GEA24.J244_37 GEA24.J244_38 GEA24.J244_39 GEA24.J244_40 GEA24.J244_42 GEA24.J244_43 GEA24.J244_44 GEA24.J244_45 GEA24.J244_46 GEA24.J244_47 GEA24.J244_48 GEA24.J244_49 GEA24.J244_50 GMA-245.2402_1 GMA-245.2402_2 GMA-245.2402_3 GMA-245.2402_4 GMA-245.2402_6 GMA-245.2402_7 GMA-245.2403_5 GMA-245.J2401_1 GMA-245.J2401_2 GMA-245.J2401_3 GMA-245.J2401_4 GMA-245.J2401_5 GMA-245.J2401_6 GMA-245.J2401_7 GMA-245.J2401_8 GMA-245.J2401_16 GMA-245.J2401_17 GMA-245.J2401_18 GMA-245.J2401_19 GMA-245.J2401_20 GMA-245.J2401_21 GMA-245.J2401_22 GMA-245.J2401_23 GMA-245.J2401_24 GMA-245.J2401_25 GMA-245.J2401_26 GMA-245.J2401_27 GMA-245.J2401_28 GMA-245.J2401_29 GMA-245.J2401_31 GMA-245.J2401_32 GMA-245.J2401_33 GMA-245.J2401_34 GMA-245.J2401_35 GMA-245.J2401_38 GMA-245.J2401_39 GMA-245.J2401_40 GMA-245.J2401_41 GMA-245.J2401_42 GMA-245.J2401_43 GMA-245.J2401_44 GMA-245.J2402_12 GMA-245.J2402_13 GMA-245.J2402_14 GMA-245.J2402_15 GMA-245.J2402_16 GMA-245.J2402_17 GMA-245.J2402_18 GMA-245.J2402_19 GMA-245.J2402_20 GMA-245.J2402_21 GMA-245.J2402_22 GMA-245.J2402_23 GMA-245.J2402_24 GMA-245.J2402_25 GMA-245.J2402_26 GMA-245.J2402_27 GMA-245.J2402_28 GMA-245.J2402_29 GMA-245.J2402_30 GMA-245.J2402_31 GMA-245.J2402_32 GMA-245.J2402_33 GMA-245.J2402_34 GMA-245.J2402_35 GMA-245.J2402_36 GMA-245.J2402_37 GMA-245.J2402_38 GMA-245.J2402_39 GMA-245.J2402_40 GMA-245.J2402_41 GMA-245.J2402_42 GMA-245.J2402_43 GMA-245.J2402_44 GSU25_BACKUP.12V_MAG_PWR GSU25_BACKUP.AIRCRAFT_POWER2 GSU25_BACKUP.GND3 GSU25_BACKUP.GND4 GSU25_BACKUP.MAG_GND GSU25_BACKUP.OAT_HIGH GSU25_BACKUP.OAT_LOW GSU25_BACKUP.OAT_PWR GSU25_BACKUP.RS232_RX1 GSU25_BACKUP.RS232_RX3 GSU25_BACKUP.RS232_TX1 GSU25_BACKUP.RS232_TX2 GSU25_BACKUP.RS232_TX3 GSU25_BACKUP.RS485_RXA GSU25_BACKUP.RS485_RXB GSU25_BACKUP.RSV GSU25_BACKUP.RSV2 GSU25_PRIMARY.GND3 GSU25_PRIMARY.GND4 GSU25_PRIMARY.RS232_RX1 GSU25_PRIMARY.RS232_RX3 GSU25_PRIMARY.RS232_TX1 GSU25_PRIMARY.RS232_TX2 GSU25_PRIMARY.RS232_TX3 GSU25_PRIMARY.RSV GSU25_PRIMARY.RSV2 GSU25_PRIMARY.UNIT_ID1 GSU25_PRIMARY.UNIT_ID1_GND GTN650.P1001_1 GTN650.P1001_2 GTN650.P1001_3 GTN650.P1001_4 GTN650.P1001_6 GTN650.P1001_7 GTN650.P1001_8 GTN650.P1001_9 GTN650.P1001_11 GTN650.P1001_12 GTN650.P1001_13 GTN650.P1001_14 GTN650.P1001_15 GTN650.P1001_16 GTN650.P1001_17 GTN650.P1001_18 GTN650.P1001_21 GTN650.P1001_22 GTN650.P1001_23 GTN650.P1001_24 GTN650.P1001_25 GTN650.P1001_26 GTN650.P1001_27 GTN650.P1001_28 GTN650.P1001_30 GTN650.P1001_31 GTN650.P1001_32 GTN650.P1001_33 GTN650.P1001_34 GTN650.P1001_35 GTN650.P1001_36 GTN650.P1001_37 GTN650.P1001_38 GTN650.P1001_39 GTN650.P1001_40 GTN650.P1001_41 GTN650.P1001_42 GTN650.P1001_43 GTN650.P1001_44 GTN650.P1001_45 GTN650.P1001_46 GTN650.P1001_47 GTN650.P1001_49 GTN650.P1001_50 GTN650.P1001_51 GTN650.P1001_52 GTN650.P1001_53 GTN650.P1001_54 GTN650.P1001_55 GTN650.P1001_56 GTN650.P1001_57 GTN650.P1001_58 GTN650.P1001_59 GTN650.P1001_60 GTN650.P1001_61 GTN650.P1001_62 GTN650.P1001_63 GTN650.P1001_64 GTN650.P1001_65 GTN650.P1001_66 GTN650.P1001_68 GTN650.P1001_69 GTN650.P1001_70 GTN650.P1001_71 GTN650.P1001_72 GTN650.P1001_73 GTN650.P1001_74 GTN650.P1001_75 GTN650.P1001_76 GTN650.P1002_1 GTN650.P1002_2 GTN650.P1002_3 GTN650.P1002_4 GTN650.P1002_5 GTN650.P1002_6 GTN650.P1002_7 GTN650.P1002_8 GTN650.P1002_9 GTN650.P1002_11 GTN650.P1002_12 GTN650.P1002_13 GTN650.P1002_14 GTN650.P1002_15 GTN650.P1002_16 GTN650.P1002_17 GTN650.P1002_18 GTN650.P1002_19 GTN650.P1002_20 GTN650.P1002_21 GTN650.P1002_22 GTN650.P1003_1 GTN650.P1003_2 GTN650.P1003_3 GTN650.P1003_4 GTN650.P1003_6 GTN650.P1003_8 GTN650.P1003_9 GTN650.P1003_10 GTN650.P1003_12 GTN650.P1003_13 GTN650.P1003_14 GTN650.P1003_15 GTN650.P1003_16 GTN650.P1003_17 GTN650.P1003_19 GTN650.P1003_21 GTN650.P1003_22 GTN650.P1003_23 GTN650.P1003_24 GTN650.P1003_25 GTN650.P1003_26 GTN650.P1003_27 GTN650.P1003_28 GTN650.P1003_29 GTN650.P1003_31 GTN650.P1003_32 GTN650.P1003_33 GTN650.P1003_34 GTN650.P1003_35 GTN650.P1003_36 GTN650.P1003_39 GTN650.P1003_41 GTN650.P1003_42 GTN650.P1004_1 GTN650.P1004_2 GTN650.P1004_3 GTN650.P1004_4 GTN650.P1004_5 GTN650.P1004_6 GTN650.P1004_7 GTN650.P1004_8 GTN650.P1004_9 GTN650.P1004_10 GTN650.P1004_11 GTN650.P1004_12 GTN650.P1004_13 GTN650.P1004_14 GTN650.P1004_15 GTN650.P1004_16 GTN650.P1004_17 GTN650.P1004_18 GTN650.P1004_19 GTN650.P1004_20 GTN650.P1004_21 GTN650.P1004_22 GTN650.P1004_25 GTN650.P1004_26 GTN650.P1004_27 GTN650.P1004_28 GTN650.P1004_29 GTN650.P1004_30 GTN650.P1004_31 GTN650.P1004_32 GTN650.P1004_33 GTN650.P1004_34 GTN650.P1004_35 GTN650.P1004_36 GTN650.P1004_37 GTN650.P1004_38 GTN650.P1004_39 GTN650.P1004_40 GTN650.P1004_41 GTN650.P1004_42 GTN650.P1004_43 GTN650.P1004_44 GTN650.P1004_45 GTN650.P1004_46 GTN650.P1004_47 GTN650.P1004_48 GTN650.P1004_49 GTN650.P1004_50 GTN650.P1004_53 GTN650.P1004_54 GTN650.P1004_55 GTN650.P1004_56 GTN650.P1004_57 GTN650.P1004_58 GTN650.P1004_59 GTN650.P1004_60 GTR-20.J2001_2 GTR-20.J2001_3 GTR-20.J2001_4 GTR-20.J2001_6 GTR-20.J2001_7 GTR-20.J2001_8 GTR-20.J2001_9 GTR-20.J2001_11 GTR-20.J2001_12 GTR-20.J2001_13 GTR-20.J2001_14 GTR-20.J2001_15 GTR-20.J2001_16 GTR-20.J2001_18 GTR-20.J2001_19 GTR-20.J2001_21 GTR-20.J2001_22 GTR-20.J2001_23 GTR-20.J2001_24 GTR-20.J2001_25 GTR-20.J2001_26 GTR-20.J2001_27 GTR-20.J2001_28 GTR-20.J2001_30 GTR-20.J2001_31 GTR-20.J2001_32 GTR-20.J2001_33 GTR-20.J2001_34 GTR-20.J2001_37 GTX45R.P3251_1 GTX45R.P3251_2 GTX45R.P3251_3 GTX45R.P3251_4 GTX45R.P3251_5 GTX45R.P3251_6 GTX45R.P3251_7 GTX45R.P3251_8 GTX45R.P3251_9 GTX45R.P3251_10 GTX45R.P3251_11 GTX45R.P3251_12 GTX45R.P3251_13 GTX45R.P3251_14 GTX45R.P3251_15 GTX45R.P3251_16 GTX45R.P3251_17 GTX45R.P3251_18 GTX45R.P3251_19 GTX45R.P3251_22 GTX45R.P3251_23 GTX45R.P3251_24 GTX45R.P3251_25 GTX45R.P3251_26 GTX45R.P3251_27 GTX45R.P3251_28 GTX45R.P3251_29 GTX45R.P3251_30 GTX45R.P3251_31 GTX45R.P3251_32 GTX45R.P3251_33 GTX45R.P3251_34 GTX45R.P3251_35 GTX45R.P3251_36 GTX45R.P3251_37 GTX45R.P3251_39 GTX45R.P3251_40 GTX45R.P3251_43 GTX45R.P3251_44 GTX45R.P3251_45 GTX45R.P3251_46 GTX45R.P3251_47 GTX45R.P3251_48 GTX45R.P3251_49 GTX45R.P3251_50 GTX45R.P3251_51 GTX45R.P3251_52 GTX45R.P3251_53 GTX45R.P3251_54 GTX45R.P3251_55 GTX45R.P3251_56 GTX45R.P3251_57 GTX45R.P3251_58 GTX45R.P3251_60 GTX45R.P3252_3 GTX45R.P3252_4 GTX45R.P3252_5 GTX45R.P3252_8 GTX45R.P3252_9 GTX45R.P3252_10 GTX45R.P3252_11 GTX45R.P3252_12 GTX45R.P3252_13 GTX45R.P3252_14 GTX45R.P3252_15 LANDING/TAXI.1(O) LANDING/TAXI.2(P) LANDING/TAXI.4(O1) LANDING/TAXI.5(P1) MASTER.1(O) MASTER.4(O1) PITCH.CAN-TERM1 PITCH.CAN-TERM2 PITCH.ID_STRAP_2 PITCH.RS232_TX/STRAP3 POS/STROBE.1(O) POS/STROBE.2(P) POS/STROBE.4(O1) POS/STROBE.5(P1) REVERSIONARY.1A REVERSIONARY.NC ROLL.CAN-H ROLL.CAN-L ROLL.CAN-TERM1 ROLL.CAN-TERM2 ROLL.ID_STRAP_1 ROLL.ID_STRAP_2 ROLL.TRIM_IN1 ROLL.TRIM_IN2 ROLL.TRIM_OUT1 ROLL.TRIM_OUT2 SW_AUTOPILOT.1(P) SW_BOOST.1(P) SW_PITOT.1(P) SYSTEM_32_1.CRANK SYSTEM_32_1.ECU_PWR SYSTEM_32_1.IGN1 SYSTEM_32_1.IGN2 SYSTEM_32_1.IGN_PWR SYSTEM_32_1.MAP SYSTEM_32_2.CRANK SYSTEM_32_2.ECU_PWR SYSTEM_32_2.IGN1 SYSTEM_32_2.IGN2 SYSTEM_32_2.IGN_PWR SYSTEM_32_2.MAP U$1.J1_13 U$1.J1_14 U$1.J1_15 U$1.J1_16 U$1.J2_11 U$1.J2_13 U$1.J8_1 U$3.P$1 U$4.14V_LIGHTING_BUS_HI U$4.28V_LIGHTING_BUS_HI U$4.CAN_BUS_HI_2 U$4.CAN_BUS_LO_2 U$4.CAN_BUS_TERM U$4.CDU_SYSTEM_ID_PRG4 U$4.CDU_SYSTEM_ID_PRG_2 U$4.CDU_SYSTEM_ID_PRG_3 U$4.CONFIG_MODULE_CLOCK U$4.CONFIG_MODULE_DATA U$4.CONFIG_MODULE_GROUND U$4.CONFIG_MODULE_PWR_OUT U$4.DNU1 U$4.DNU2 U$4.DNU3 U$4.DNU4 U$4.DNU5 U$4.DNU6 U$4.DNU7 U$4.DNU8 U$4.DNU9 U$4.GND U$4.GND2 U$4.MONO_AUDIO_OUT_HI U$4.MONO_AUDIO_OUT_LO U$4.PWR1 U$4.PWR2 U$4.RESERVED U$4.RS-232-IN2 U$4.RS-232-IN4 U$4.RS-232-IN5 U$4.RS-232-OUT2 U$4.RS-232-OUT4 U$4.RS-232-OUT5 U$4.RS-232-RX U$4.RS_232_TX U$4.SIGNAL_GROUND2 U$4.SIGNAL_GROUND4 U$4.SIGNAL_GROUND5 U$4.SIGNAL_GROUND6 U$4.SPARE1 U$4.SPARE2 U$4.STEREO_AUDIO_OUT_LEFT U$4.STEREO_AUDIO_OUT_LO1 U$4.STEREO_AUDIO_OUT_LO2 U$4.STEREO_AUDIO_OUT_RIGHT U$5.14V_LIGHTING_BUS_HI U$5.28V_LIGHTING_BUS_HI U$5.AIRCRAFT_POWER_1 U$5.CAN_BUS_HI_2 U$5.CAN_BUS_LO_2 U$5.CAN_BUS_TERM U$5.CDU_SYSTEM_ID_PRG4 U$5.CDU_SYSTEM_ID_PRG_1 U$5.CDU_SYSTEM_ID_PRG_2 U$5.CONFIG_MODULE_CLOCK U$5.CONFIG_MODULE_DATA U$5.CONFIG_MODULE_GROUND U$5.CONFIG_MODULE_PWR_OUT U$5.DNU1 U$5.DNU2 U$5.DNU3 U$5.DNU4 U$5.DNU5 U$5.DNU6 U$5.DNU7 U$5.DNU8 U$5.DNU9 U$5.GND U$5.GND2 U$5.MONO_AUDIO_OUT_HI U$5.MONO_AUDIO_OUT_LO U$5.PWR1 U$5.PWR2 U$5.RESERVED U$5.RS-232-IN4 U$5.RS-232-IN5 U$5.RS-232-OUT4 U$5.RS-232-OUT5 U$5.RS-232-RX U$5.RS_232_TX U$5.SIGNAL_GROUND1 U$5.SIGNAL_GROUND4 U$5.SIGNAL_GROUND5 U$5.SIGNAL_GROUND6 U$5.SPARE1 U$5.SPARE2 U$5.STEREO_AUDIO_OUT_LEFT U$5.STEREO_AUDIO_OUT_LO1 U$5.STEREO_AUDIO_OUT_LO2 U$5.STEREO_AUDIO_OUT_RIGHT U$7.2_GPS_TEST U$7.REMOTE U$9.LIGHTING_BUS_HI(11) U$9.LIGHTING_BUS_LOW(12) U$9.P$10 U$9.P$13 U$9.P$14 U$9.SIGNAL_GND2(8) U$9.SIGNAL_GND(6) U$10.1 U$11.SPARE1 U$11.SPARE2 USB.1(P) USB.2(S) X-FEED.1(O) X-FEED.3(S) X-FEED.4(O1) YAW.ID_STRAP_1 YAW.RS232_RX/STRAP4 YAW.TRIM_IN1 YAW.TRIM_IN2 YAW.TRIM_OUT1 YAW.TRIM_OUT2

## Buses
MAIN_BATTERY_BUS
TAIL_STROBE
PITCH_TRIM1
PITCH_DATA
GMU_22_PWR
GMU_22_485
PITCH_TRIM_2
CAN_BUS_PITCH_SERVO
B$7
OAT
GND

## Notes on the sheet
- Tail
- AUX_BUSS_Voltage
- Mid-Fuse

## Library data of the parts
1224 = EAA:PLANEPWR_VREG; _EXTERNAL_: _EXTERNAL_
ALT_BACKUP ALT_PRIMARY = EAA:PLANE_POWER; _EXTERNAL_: _EXTERNAL_
ALT_SEL AVIONICS LANDING/TAXI MASTER POS/STROBE X-FEED = switch:TL46YO: TINY SWITCH ON - ON Source: http://www2.produktinfo.conrad.com/datenblaetter/700000-724999/705152-da-01-de-Subminiaturschalter_TL_36YO.pdf; SPICEPREFIX: X
ANL1 ANL2 = EAA:ANL; _EXTERNAL_: _EXTERNAL_
ANT-ELT = discrete:ANTENNA: Antenna
AUX MAIN = battery:SL-160AA/PR: LI BATTERY Sonnenschein
AUX_FUSEBLOCK = EAA:11-13348; _EXTERNAL_: _EXTERNAL_
BKR_IGN1 = EAA:BREAKER; _EXTERNAL_: _EXTERNAL_
COWL_FLAP IGN1 SW_AUTOPILOT SW_BOOST SW_PITOT USB = switch-omron:31-XX: OMRON SWITCH; MPN: B3F-3100; OC_FARNELL: 959704; OC_NEWARK: 36M3582
EYEBALL_LIGHT = led:LED: LED OSRAM: - CHIPLED LG R971, LG N971, LY N971, LG Q971, LY Q971, LO R971, LY R971 LH N974, LH R974 LS Q976, LO Q976, LY Q976 LO Q996 - Hyper CHIPLED LW Q18S LB Q993, LB Q99A, LB R99A - SideLED LS A670, LO A670, LY A670, LG A670, LP A670 LB A673, LV A673, LT A673, LW A673 LH A674 LY A675 LS A676, LA A676, LO A676, LY A676, LW A676 LS A679, LY A679, LG A679 - Hyper Micro SIDELED® LS Y876, LA Y876, LO Y876, LY Y876 LT Y87S - SmartLED LW L88C, LW L88S LB L89C, LB L89S, LG L890 LS L89K, LO L89K, LY L89K LS L896, LA L896, LO L896, LY L896 - TOPLED LS T670, LO T670, LY T670, LG T670, LP T670 LSG T670, LSP T670, LSY T670, LOP T670, LYG T670 LG T671, LOG T671, LSG T671 LB T673, LV T673, LT T673, LW T673 LH T674 LS T676, LA T676, LO T676, LY T676, LB T676, LH T676, LSB T676, LW T676 LB T67C, LV T67C, LT T67C, LS T67K, LO T67K, LY T67K, LW E67C LS E67B, LA E67B, LO E67B, LY E67B, LB E67C, LV E67C, LT E67C LW T67C LS T679, LY T679, LG T679 LS T770, LO T770, LY T770, LG T770, LP T770 LB T773, LV T773, LT T773, LW T773 LH T774 LS E675, LA E675, LY E675, LS T675 LS T776, LA T776, LO T776, LY T776, LB T776 LHGB T686 LT T68C, LB T68C - Hyper Mini TOPLED® LB M676 - Mini TOPLED Santana® LG M470 LS M47K, LO M47K, LY M47K Source: http://www.osram.convergy.de LUXEON: - LUMILED® LXK2-PW12-R00, LXK2-PW12-S00, LXK2-PW14-U00, LXK2-PW14-V00 LXK2-PM12-R00, LXK2-PM12-S00, LXK2-PM14-U00 LXK2-PE12-Q00, LXK2-PE12-R00, LXK2-PE12-S00, LXK2-PE14-T00, LXK2-PE14-U00 LXK2-PB12-K00, LXK2-PB12-L00, LXK2-PB12-M00, LXK2-PB14-N00, LXK2-PB14-P00, LXK2-PB14-Q00 LXK2-PR12-L00, LXK2-PR12-M00, LXK2-PR14-Q00, LXK2-PR14-R00 LXK2-PD12-Q00, LXK2-PD12-R00, LXK2-PD12-S00 LXK2-PH12-R00, LXK2-PH12-S00 LXK2-PL12-P00, LXK2-PL12-Q00, LXK2-PL12-R00 Source: www.luxeon.com KINGBRIGHT: KA-3528ASYC Source: www.kingbright.com
FT-60 FUEL MANIFOLD OIL = EAA:PRESSURE_SENSOR
GAD29 = EAA:GAD29; _EXTERNAL_: _EXTERNAL_
GDL51R = EAA:GDL51; _EXTERNAL_: _EXTERNAL_
GEA24 = EAA:GEA24; _EXTERNAL_: _EXTERNAL_
GMA-245 = EAA:GMA-245; _EXTERNAL_: _EXTERNAL_
GSU25_BACKUP GSU25_PRIMARY = EAA:GSU25; _EXTERNAL_: _EXTERNAL_
GTN650 = EAA:GTN_650; _EXTERNAL_: _EXTERNAL_
GTP59 = EAA:GTP59; _EXTERNAL_: _EXTERNAL_
GTR-20 = EAA:GTR20; _EXTERNAL_: _EXTERNAL_
GTX45R = EAA:GTX45R
LED1 = led:TLLR4400: Low Current (2mA) LED 3 mm Tinted Diffused Package color RED Source: Data sheet <http://www.farnell.com/datasheets/391100.pdf>; MF: VISHAY SEMICONDUCTOR; OC_FARNELL: 1612437
MASTER_CONTACTOR MASTER_CONTACTOR1 MASTER_CONTACTOR2 = EAA:MASTER_CONTACTOR; _EXTERNAL_: _EXTERNAL_
OIL_SWITCH = EAA:PRESSURE_SWITCH
PITCH ROLL YAW = EAA:GSA28; _EXTERNAL_: _EXTERNAL_
PITCH_TRIM = EAA:RAYALLEN_T2; _EXTERNAL_: _EXTERNAL_
PITOT_HEAT = EAA:GAP26; _EXTERNAL_: _EXTERNAL_
POSI-STROBE = EAA:POSISTROBE; _EXTERNAL_: _EXTERNAL_
R2 = rcl:R-US_: RESISTOR, American symbol
REVERSIONARY = switch:55?: PUSHBUTTON SERIES 5500 SWITCHES Source: www.e-switch.com .. 5500.pdf
STARTER_SWITCH = EAA:ACS_A510_2
SYSTEM_32_1 SYSTEM_32_2 = EAA:SYSTEM_32; _EXTERNAL_: _EXTERNAL_
U$1 = EAA:VPX_PRO; _EXTERNAL_: _EXTERNAL_
U$2 = EAA:STARTER_CONTACTOR; _EXTERNAL_: _EXTERNAL_
U$3 = EAA:HOBBS_METER
U$4 U$5 = EAA:GDU_45X; _EXTERNAL_: _EXTERNAL_
U$6 = EAA:BULKHEAD; _EXTERNAL_: _EXTERNAL_
U$7 = EAA:ACK_E04; _EXTERNAL_: _EXTERNAL_
U$8 = EAA:THERMOCOUPLE
U$9 = EAA:GMC307; _EXTERNAL_: _EXTERNAL_
U$10 = EAA:SHUNT; _EXTERNAL_: _EXTERNAL_
U$11 = EAA:GMU22; _EXTERNAL_: _EXTERNAL_